# Altium project PFSMPS20.PrjPCB
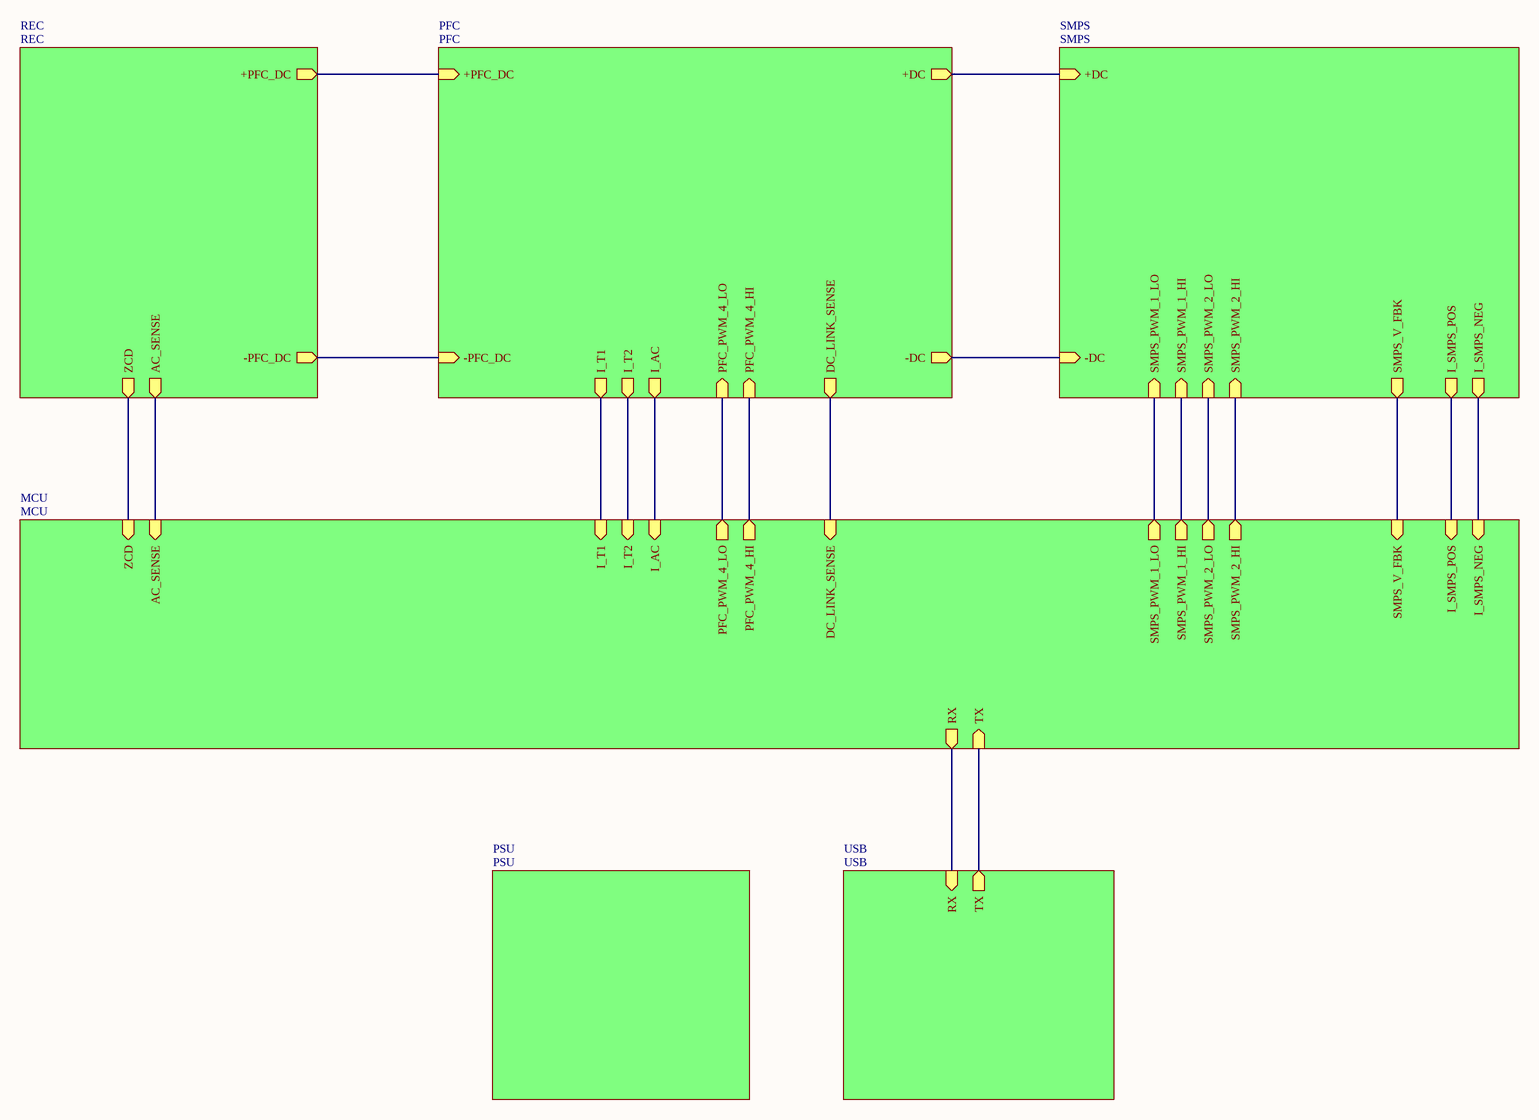
[diagram p0: Main.SchDoc]
7 sheets, 278 parts. Net scope: hierarchical (ports join the sheet entries above them; power ports are global).
Board file: PFSMPS20.PcbDoc
Sheets:
  Main.SchDoc
    REC = REC.SchDoc
    PFC = PFC.SchDoc
    SMPS = SMPS.SchDoc
    PSU = PSU.SchDoc
    USB = USB.SchDoc
    MCU = MCU.SchDoc

## Sheet Main.SchDoc
size A3; Organization: Altium Limited; Address1: L3, 12a Rodborough Rd; Address2: Frenchs Forest; Address3: NSW; Address4: Australia 2086

### Sub-sheets
MCU = MCU: RX (out), TX (in), I_T1 (in), I_T2 (in), I_AC (in), PFC_PWM_4_LO (out), PFC_PWM_4_HI (out), DC_LINK_SENSE (in), SMPS_PWM_2_LO (out), SMPS_PWM_2_HI (out), AC_SENSE (in), ZCD (in), SMPS_V_FBK (in), SMPS_PWM_1_LO (out), SMPS_PWM_1_HI (out), I_SMPS_POS (in), I_SMPS_NEG (in)
PFC = PFC: +PFC_DC (in), -PFC_DC (in), +DC (out), -DC (out), I_T1 (out), I_T2 (out), I_AC (out), PFC_PWM_4_LO (in), PFC_PWM_4_HI (in), DC_LINK_SENSE (out)
PSU = PSU: no entries
REC = REC: +PFC_DC (out), -PFC_DC (out), AC_SENSE (out), ZCD (out)
SMPS = SMPS: +DC (in), -DC (in), SMPS_PWM_2_LO (in), SMPS_PWM_2_HI (in), SMPS_V_FBK (out), SMPS_PWM_1_HI (in), SMPS_PWM_1_LO (in), I_SMPS_POS (out), I_SMPS_NEG (out)
USB = USB: RX (in), TX (out)

### Nets
NetC6_2: sheet PFC/DC_LINK_SENSE, sheet MCU/DC_LINK_SENSE
NetC9_2: sheet REC/AC_SENSE, sheet MCU/AC_SENSE
NetC26_1: sheet REC/-PFC_DC, sheet PFC/-PFC_DC
NetC26_2: sheet REC/+PFC_DC, sheet PFC/+PFC_DC
NetC32_1: sheet PFC/+DC, sheet SMPS/+DC
NetC32_2: sheet PFC/-DC, sheet SMPS/-DC
NetC37_1: sheet PFC/I_T2, sheet MCU/I_T2
NetC38_1: sheet PFC/I_T1, sheet MCU/I_T1
NetC48_2: sheet PFC/I_AC, sheet MCU/I_AC
NetC82_2: sheet SMPS/SMPS_V_FBK, sheet MCU/SMPS_V_FBK
NetD5_K: sheet REC/ZCD, sheet MCU/ZCD
NetD27_1: sheet SMPS/I_SMPS_NEG, sheet MCU/I_SMPS_NEG
NetD27_2: sheet SMPS/I_SMPS_POS, sheet MCU/I_SMPS_POS
NetR32_2: sheet USB/TX, sheet MCU/TX
NetR64_1: sheet PFC/PFC_PWM_4_HI, sheet MCU/PFC_PWM_4_HI
NetR71_1: sheet PFC/PFC_PWM_4_LO, sheet MCU/PFC_PWM_4_LO
NetR101_2: sheet SMPS/SMPS_PWM_1_HI, sheet MCU/SMPS_PWM_1_HI
NetR106_2: sheet SMPS/SMPS_PWM_1_LO, sheet MCU/SMPS_PWM_1_LO
NetR116_2: sheet SMPS/SMPS_PWM_2_HI, sheet MCU/SMPS_PWM_2_HI
NetR120_2: sheet SMPS/SMPS_PWM_2_LO, sheet MCU/SMPS_PWM_2_LO
NetU2_32: sheet USB/RX, sheet MCU/RX

### Notes on the sheet
- Title
- Size:
- Date:
- A3
- Number:
- Time:
- Revision:
- Sheet
- of
- File:

## Sheet REC.SchDoc
size A3; Organization: Altium Limited; Address1: L3, 12a Rodborough Rd; Address2: Frenchs Forest; Address3: NSW; Address4: Australia 2086
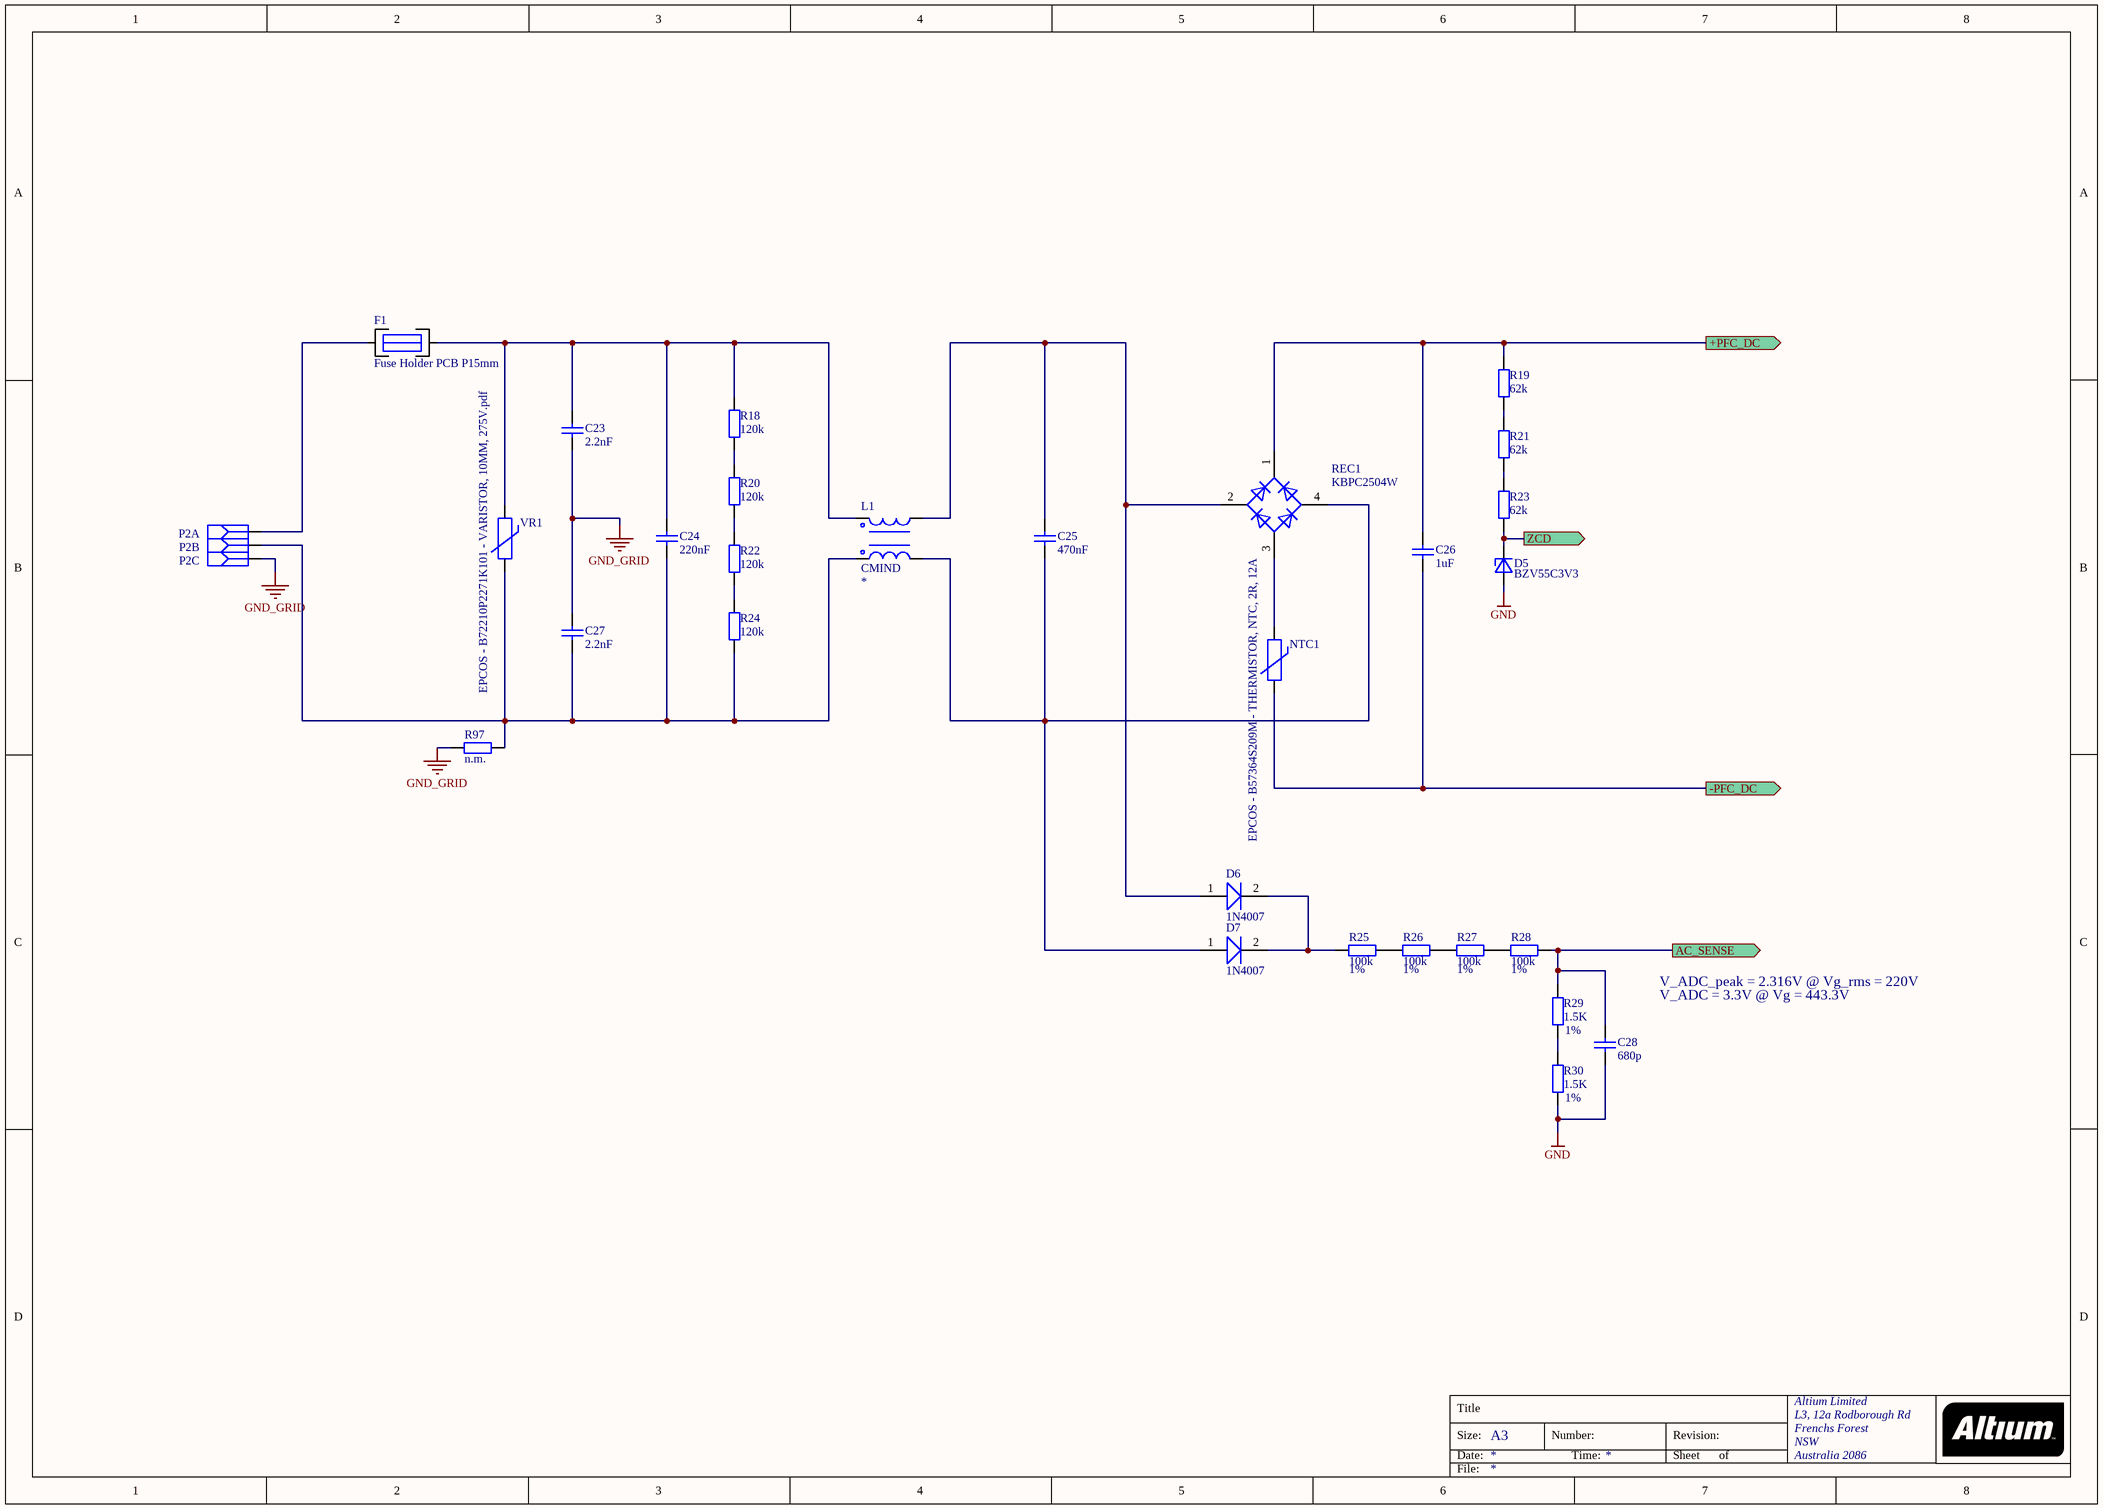
[diagram p1: REC.SchDoc]

### Parts
C23  value 2.2nF  [RECT 18.0X7.0 RM15.0]  (hidden comment: Cap)
C24  value 220nF  [RECT 18.0X7.0 RM15.0]  (hidden comment: Cap)
C25  value 470nF  [RECT 18.0X7.0 RM15.0]  (hidden comment: Cap)
C26  value 1uF  [RECT 18.0X7.0 RM15.0]  (hidden comment: Cap)
C27  value 2.2nF  [RECT 18.0X7.0 RM15.0]  (hidden comment: Cap)
C28  value 680p  [1206_REFLOW]  (hidden comment: Cap 1206)
D5  value BZV55C3V3  [D_MINIMELF_BZV55C5V1(Primary)]  (hidden comment: BZV55CXXX)
D6  1N4007  [AFL-W2/X1.8D]
D7  1N4007  [AFL-W2/X1.8D]
F1  Fuse Holder PCB P15mm  [Fuse Holder PCB P15mm]
L1  CMIND  [CommonModeChoke]
NTC1  value EPCOS - B57364S209M - THERMISTOR, NTC, 2R, 12A  [VARISTOR_14]  (hidden comment: Varristor)
P2  MSTBA 2,5/ 3-G-5,08  [MSTBA2.5/3G-5.08]  (value not drawn)  (parts A,B,C of 3)
R18  value 120k  [1206_REFLOW]  (hidden comment: RES)
R19  value 62k  [RA161004]  (hidden comment: RES)
R20  value 120k  [1206_REFLOW]  (hidden comment: RES)
R21  value 62k  [RA161004]  (hidden comment: RES)
R22  value 120k  [1206_REFLOW]  (hidden comment: RES)
R23  value 62k  [RA161004]  (hidden comment: RES)
R24  value 120k  [1206_REFLOW]  (hidden comment: RES)
R25  value 100k  Tolerance: 1%  [RA161004]  (hidden comment: RES)
R26  value 100k  Tolerance: 1%  [RA161004]  (hidden comment: RES)
R27  value 100k  Tolerance: 1%  [RA161004]  (hidden comment: RES)
R28  value 100k  Tolerance: 1%  [RA161004]  (hidden comment: RES)
R29  value 1.5K  Tolerance: 1%  [RA161004]  (hidden comment: RES)
R30  value 1.5K  Tolerance: 1%  [RA161004]  (hidden comment: RES)
R97  value n.m.  [1206_REFLOW]  (hidden comment: RES)
REC1  KBPC2504W  [KBPC2504W]
VR1  value EPCOS - B72210P2271K101 - VARISTOR, 10MM, 275V.pdf  [VARISTOR_14]  (hidden comment: Varristor)

### Ports
+PFC_DC (out), -PFC_DC (out), AC_SENSE (out), ZCD (out)

### Nets
GND: C28.1 D5.A R30.2
GND_GRID: C23.1 C27.2 P2.3(SIG) R97.1
NetC9_2: C28.2 R28.2 R29.1 ; port AC_SENSE
NetC23_2: C23.2 C24.2 F1.2 L1.1 R18.1 VR1.1
NetC24_1: C24.1 C27.1 L1.3 P2.2(SIG) R24.2 R97.2 VR1.2
NetC25_1: C25.1 D7.1(A) L1.4 REC1.4(C)
NetC25_2: C25.2 D6.1(A) L1.2 REC1.2(C)
NetC26_1: C26.1 NTC1.2 ; port -PFC_DC
NetC26_2: C26.2 R19.1 REC1.1(K) ; port +PFC_DC
NetD5_K: D5.K R23.2 ; port ZCD
NetD6_2: D6.2(K) D7.2(K) R25.1
NetF1_1: F1.1 P2.1(SIG)
NetNTC1_1: NTC1.1 REC1.3(A)
NetR18_2: R18.2 R20.1
NetR19_2: R19.2 R21.1
NetR20_2: R20.2 R22.1
NetR21_2: R21.2 R23.1
NetR22_2: R22.2 R24.1
NetR25_2: R25.2 R26.1
NetR26_2: R26.2 R27.1
NetR27_2: R27.2 R28.1
NetR29_2: R29.2 R30.1

### Notes on the sheet
- V_ADC_peak = 2.316V @ Vg_rms = 220V
- V_ADC = 3.3V @ Vg = 443.3V
- Title
- Size:
- Date:
- A3
- Number:
- Time:
- Revision:
- Sheet
- of
- File:

### Library data of the parts
D5 = BZV55CXXX: Zener Diode
D6 D7 = 1N4007: 1.0 Ampere General Purpose Rectifier; ComponentField6: Published 8-Jun-2000, Modified 11-July-2000: SIM Model Added.; OriginalName: 1N4007; Value: 1N4007
NTC1 VR1 = VAR
  NTC1: Farnell Order Number: 1688802
  VR1: Farnell Order Number: 1781925
P2 = MSTBA 2,5/ 3-G-5,08: Header, right angled, 12 A, 250 V, pitch 5.08 mm, No. of poles:4; Manufacturer: Phoenix; Mfrr. Part No.: 1757268; Group: Connector; Subgroup: Industrial; Value: MSTBA2,5/3; Mounting: TH; Supplier: Any; Order Code: *
R18 R20 R22 R24-R30 R97 = RES 1
  R97: Tolerance: *
R19 R21 R23 = RES 1: Tolerance: 1%
F1 = Fuse Holder PCB P15mm: Value: Fuse Holder PCB P15mm
L1 = CMIND: Value: *
REC1 = KBPC2504W: Value: KBPC2504W

## Sheet PFC.SchDoc
size A3; Organization: Altium Limited; Address1: L3, 12a Rodborough Rd; Address2: Frenchs Forest; Address3: NSW; Address4: Australia 2086
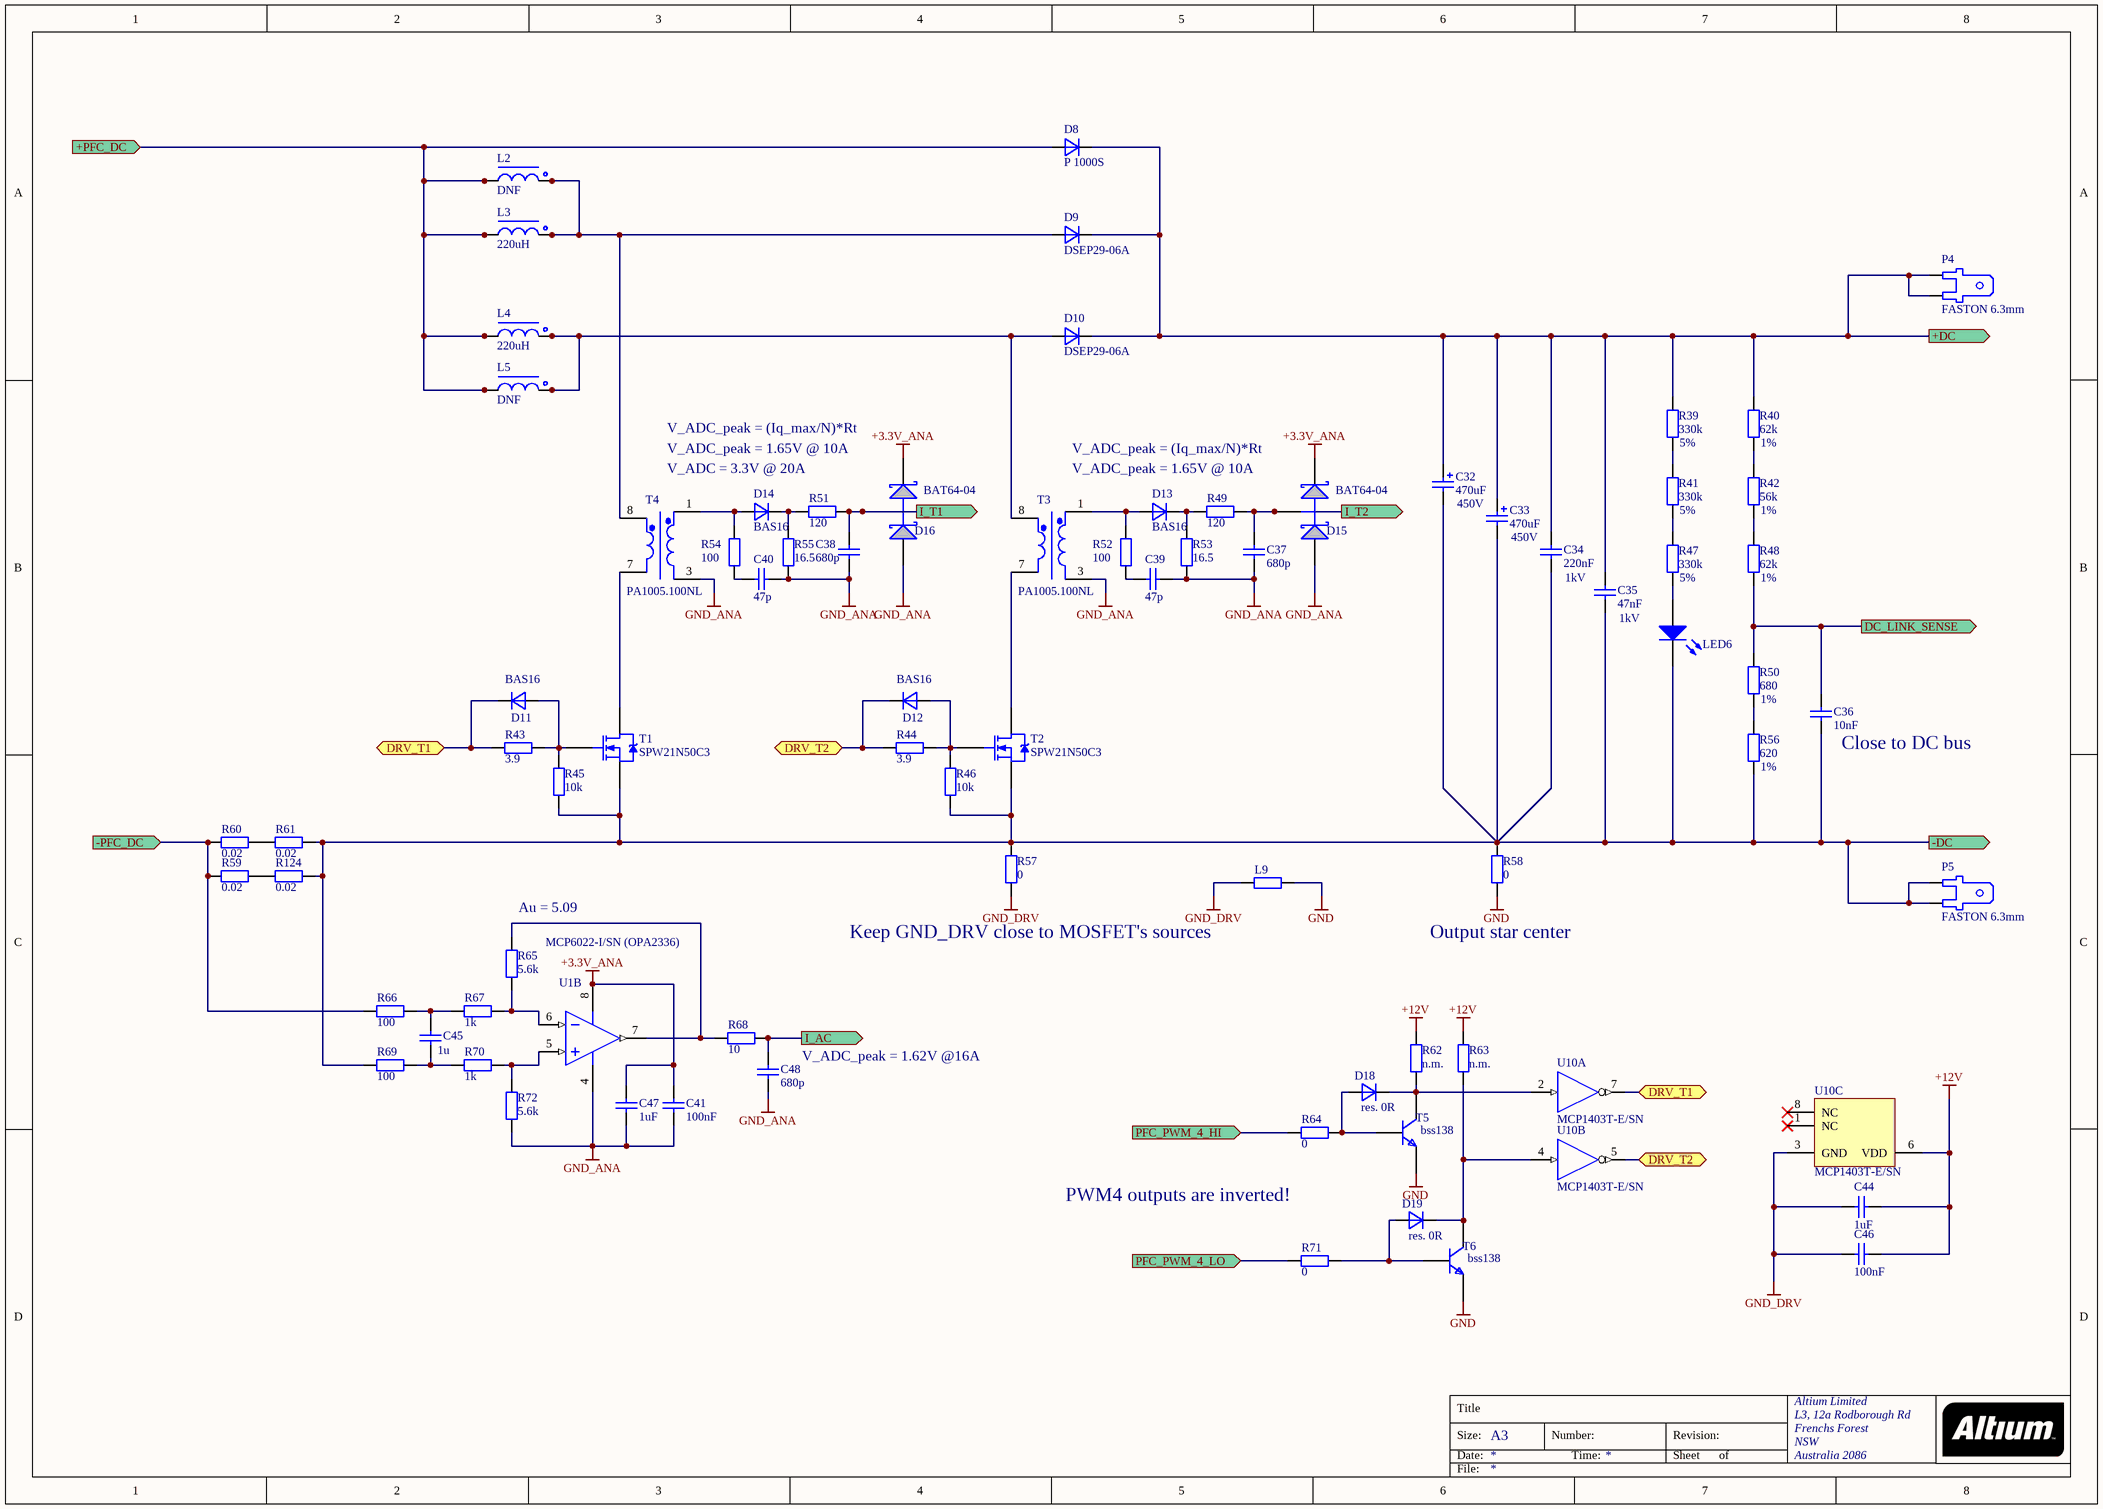
[diagram p2: PFC.SchDoc]

### Parts
C32  value 470uF  Voltage: 450V  [CAPR 52X35]  (hidden comment: Cap)
C33  value 470uF  Voltage: 450V  [CAPR 52X35]  (hidden comment: Cap)
C34  value 220nF  Voltage: 1kV  [RECT 31.0X11.0 RM27.5]  (hidden comment: Cap)
C35  value 47nF  Voltage: 1kV  [RECT 26.5X7.0 RM22.5]  (hidden comment: Cap)
C36  value 10nF  [1206_REFLOW]  (hidden comment: Cap 1206)
C37  value 680p  [1206_REFLOW]  (hidden comment: Cap 1206)
C38  value 680p  [1206_REFLOW]  (hidden comment: Cap 1206)
C39  value 47p  [1206_REFLOW]  (hidden comment: Cap 1206)
C40  value 47p  [1206_REFLOW]  (hidden comment: Cap 1206)
C41  value 100nF  [1206_REFLOW]  (hidden comment: Cap)
C44  value 1uF  [1206_REFLOW]  (hidden comment: Cap 1206)
C45  value 1u  [1206_REFLOW]  (hidden comment: Cap)
C46  value 100nF  [1206_REFLOW]  (hidden comment: Cap 1206)
C47  value 1uF  [1206_REFLOW]  (hidden comment: Cap)
C48  value 680p  [1206_REFLOW]  (hidden comment: Cap)
D8  P 1000S  [P 1000 S]
D9  DSEP29-06A  [Diode TO-220AC-HV]
D10  DSEP29-06A  [Diode TO-220AC-HV]
D11  BAS16  [SOT23_HIS_Primary]
D12  BAS16  [SOT23_HIS_Primary]
D13  BAS16  [SOT23_HIS_Primary]
D14  BAS16  [SOT23_HIS_Primary]
D15  BAT64-04  [SOT23_HIS_Primary]
D16  BAT64-04  [SOT23_HIS_Primary]
D18  value res. 0R  [SOT23_HIS_Primary]  (hidden comment: BAS16)
D19  value res. 0R  [SOT23_HIS_Primary]  (hidden comment: BAS16)
L2  value DNF  [RM-14]  (hidden comment: RM-14 Choke)
L3  value 220uH  [RM-10]  (hidden comment: RM-10 Choke)
L4  value 220uH  [RM-10]  (hidden comment: RM-10 Choke)
L5  value DNF  [RM-14]  (hidden comment: RM-14 Choke)
L9  RES  [1206_REFLOW]  (value not drawn)
LED6  LED  [LED_1206]  (value not drawn)
P4  FASTON 6.3MM  [FASTON 6.3mm]
P5  FASTON 6.3MM  [FASTON 6.3mm]
R39  value 330k  Tolerance: 5%  [RA161004]  (hidden comment: RES)
R40  value 62k  Tolerance: 1%  [RA161004]  (hidden comment: RES)
R41  value 330k  Tolerance: 5%  [RA161004]  (hidden comment: RES)
R42  value 56k  Tolerance: 1%  [RA161004]  (hidden comment: RES)
R43  value 3.9  [1206_REFLOW]  (hidden comment: RES)
R44  value 3.9  [1206_REFLOW]  (hidden comment: RES)
R45  value 10k  [1206_REFLOW]  (hidden comment: RES)
R46  value 10k  [1206_REFLOW]  (hidden comment: RES)
R47  value 330k  Tolerance: 5%  [RA161004]  (hidden comment: RES)
R48  value 62k  Tolerance: 1%  [RA161004]  (hidden comment: RES)
R49  value 120  [1206_REFLOW]  (hidden comment: RES)
R50  value 680  Tolerance: 1%  [RA161004]  (hidden comment: RES)
R51  value 120  [1206_REFLOW]  (hidden comment: RES)
R52  value 100  [1206_REFLOW]  (hidden comment: RES)
R53  value 16.5  [1206_REFLOW]  (hidden comment: RES)
R54  value 100  [1206_REFLOW]  (hidden comment: RES)
R55  value 16.5  [1206_REFLOW]  (hidden comment: RES)
R56  value 620  Tolerance: 1%  [RA161004]  (hidden comment: RES)
R57  value 0  [1206_REFLOW]  (hidden comment: RES)
R58  value 0  [1206_REFLOW]  (hidden comment: RES)
R59  value 0.02  [2512_REFLOW]  (hidden comment: RES)
R60  value 0.02  [2512_REFLOW]  (hidden comment: RES)
R61  value 0.02  [2512_REFLOW]  (hidden comment: RES)
R62  value n.m.  [1206_REFLOW]  (hidden comment: RES)
R63  value n.m.  [1206_REFLOW]  (hidden comment: RES)
R64  value 0  [1206_REFLOW]  (hidden comment: RES)
R65  value 5.6k  [1206_REFLOW]  (hidden comment: RES)
R66  value 100  [1206_REFLOW]  (hidden comment: RES)
R67  value 1k  [1206_REFLOW]  (hidden comment: RES)
R68  value 10  [1206_REFLOW]  (hidden comment: RES)
R69  value 100  [1206_REFLOW]  (hidden comment: RES)
R70  value 1k  [1206_REFLOW]  (hidden comment: RES)
R71  value 0  [1206_REFLOW]  (hidden comment: RES)
R72  value 5.6k  [1206_REFLOW]  (hidden comment: RES)
R124  value 0.02  [2512_REFLOW]  (hidden comment: RES)
T1  value SPW21N50C3  [TO-247HV]  (hidden comment: MOSFET, N, 500V, TO-247)
T2  value SPW21N50C3  [TO-247HV]  (hidden comment: MOSFET, N, 500V, TO-247)
T3  value PA1005.100NL  [PA1005.XXXNL Series]  (hidden comment: PA1005.XXXNL)
T4  value PA1005.100NL  [PA1005.XXXNL Series]  (hidden comment: PA1005.XXXNL)
T5  value bss138  [SOT23_HIS_Primary]  (hidden comment: BC847A)
T6  value bss138  [SOT23_HIS_Primary]  (hidden comment: BC847A)
U1  MCP6022-I/SN (OPA2336)  [SOIC-SN8_N]  (part B of 2)
U10  MCP1403T-E/SN  [SOIC-SN8_N]  (parts A,B,C of 3)

### Ports
+DC (out), +PFC_DC (in), -DC (out), -PFC_DC (in), DC_LINK_SENSE (out), DRV_T1 (bidir), DRV_T2 (bidir), I_AC (out), I_T1 (out), I_T2 (out), PFC_PWM_4_HI (in), PFC_PWM_4_LO (in)

### Nets
+3.3V_ANA: C41.2 C47.2 D15.2(K) D16.2(K) U1.8(VDD)
+12V: C44.1 C46.1 R62.1 R63.1 U10.6(VDD)
GND: L9.2 R58.2 T5.2(E) T6.2(E)
GND_ANA: C37.2 C38.2 C39.1 C40.1 C41.1 C47.1 C48.1 D15.1(A) D16.1(A) R53.1 R55.1 R72.1 T3.3(Sec2+) T4.3(Sec2+) U1.4(VSS)
GND_DRV: C44.2 C46.2 L9.1 R57.2 U10.3(GND)
NetC6_2: C36.2 R48.2 R50.1 ; port DC_LINK_SENSE
NetC26_1: R59.1 R60.1 R66.1 ; port -PFC_DC
NetC26_2: D8.A L2.7 L2.8 L2.9 L2.10 L2.11 L2.12 L3.7 L3.8 L3.9 L3.10 L3.11 L3.12 L4.7 L4.8 L4.9 L4.10 L4.11 L4.12 L5.7 L5.8 L5.9 L5.10 L5.11 L5.12 ; port +PFC_DC
NetC32_1: C32.1 C33.1 C34.2 C35.2 D8.K D9.1(K) D10.1(K) P4.1 P4.2 R39.1 R40.1 ; port +DC
NetC32_2: C32.2 C33.2 C34.1 C35.1 C36.1 LED6.K P5.1 P5.2 R45.1 R46.2 R56.2 R57.1 R58.1 R61.2 R69.1 R124.2 T1.3(S) T2.3(S) ; port -DC
NetC37_1: C37.1 D15.3(C) R49.1 ; port I_T2
NetC38_1: C38.1 D16.3(C) R51.1 ; port I_T1
NetC39_2: C39.2 R52.1
NetC40_2: C40.2 R54.1
NetC45_1: C45.1 R69.2 R70.1
NetC45_2: C45.2 R66.2 R67.1
NetC48_2: C48.2 R68.1 ; port I_AC
NetD9_2: D9.2(A) L2.1 L2.2 L2.3 L2.4 L2.5 L2.6 L3.1 L3.2 L3.3 L3.4 L3.5 L3.6 T4.8(Pri+)
NetD10_2: D10.2(A) L4.1 L4.2 L4.3 L4.4 L4.5 L4.6 L5.1 L5.2 L5.3 L5.4 L5.5 L5.6 T3.8(Pri+)
NetD11_1: D11.1(A) R43.2 R45.2 T1.1(G)
NetD11_3: D11.3(K) R43.1 U10.7(~{OUTA}) ; port DRV_T1
NetD12_1: D12.1(A) R44.1 R46.1 T2.1(G)
NetD12_3: D12.3(K) R44.2 U10.5(~{OUTB}) ; port DRV_T2
NetD13_1: D13.1(A) R52.2 T3.1(Sec1+)
NetD13_3: D13.3(K) R49.2 R53.2
NetD14_1: D14.1(A) R54.2 T4.1(Sec1+)
NetD14_3: D14.3(K) R51.2 R55.2
NetD18_1: D18.1(A) R64.2 T5.1(B)
NetD18_3: D18.3(K) R62.2 T5.3(C) U10.2(INA)
NetD19_1: D19.1(A) R71.2 T6.1(B)
NetD19_3: D19.3(K) R63.2 T6.3(C) U10.4(INB)
NetLED6_A: LED6.A R47.2
NetR39_2: R39.2 R41.1
NetR40_2: R40.2 R42.1
NetR41_2: R41.2 R47.1
NetR42_2: R42.2 R48.1
NetR50_2: R50.2 R56.1
NetR59_2: R59.2 R124.1
NetR60_2: R60.2 R61.1
NetR64_1: R64.1 ; port PFC_PWM_4_HI
NetR65_1: R65.1 R67.2 U1.6(VINB-)
NetR65_2: R65.2 R68.2 U1.7(VOUTB)
NetR70_2: R70.2 R72.2 U1.5(VINB+)
NetR71_1: R71.1 ; port PFC_PWM_4_LO
NetT1_2: T1.2(D) T4.7(Pri-)
NetT2_2: T2.2(D) T3.7(Pri-)

Not connected (* = marked no-connect by the designer): D11 2(NC); D12 2(NC); D13 2(NC); D14 2(NC); D18 2(NC); D19 2(NC); U10 1(NC)* 8(NC)*

### Notes on the sheet
- V_ADC_peak = (Iq_max/N)*Rt
- V_ADC_peak = 1.65V @ 10A
- V_ADC = 3.3V @ 20A
- (near C36) Close to DC bus
- (near R65) Au = 5.09
- Keep GND_DRV close to MOSFET's sources
- (near R58) Output star center
- V_ADC_peak = 1.62V @16A
- PWM4 outputs are inverted!
- Title
- Size:
- Date:
- A3
- Number:
- Time:
- Revision:
- Sheet
- of
- File:

### Library data of the parts
C32 C33 = Cap pol: Manufacturer: *; Manufacturer Order Code: *; Supplier Order Code: *
C34 = Cap: Manufacturer: EPCOS; Manufacturer Order Code: B32654A224J; Supplier Order Code: 1200806
C35 = Cap: Manufacturer: Epcos; Manufacturer Order Code: B32653A0473K; Supplier Order Code: 9751300
D8 = P 1000S: SEMIKRON - P1000S - DIODE, RECTIFIER, 10A, 1200V, AXIAL; Description: Standard silicon rectifier  diode; Value: P 1000S; Farnell Order Number: 1772102
D9 D10 = DSEP29-06A: HiPerFREDTM Epitaxial Diode with soft recovery; Farnell Order Number: 1427265; Value: DSEP29-06A
D11-D14 D18 D19 = BAS16: DIODE, SINGLE SOT-23; Manufacturer: Any; Group: Discrete; Subgroup1: Small Signal; Order Code: BAS16 SMD (SOT23); Subgroup: Diode; Package: SOT23; Mounting: SMD; Supplier: Comet
  D11-D14: Value: BAS16
D15 D16 = BAT64-04: Silicon Schottky Diodes; Manufacturer: INF; ComponentLink1DescBC: Manufacturer Link; Group: Discrete; Subgroup: Diode; Published: 21-Mar-2003; DatasheetDocument: Oct-1999; PackageDocument: Sep-2001; PackageReference: SOT-23; Publisher: Altium Limited; ComponentLink1URL: http://www.infineon.com/; Value: BAT64-04
L2 L5 = RM-xx Choke: Core Gap: *; Wire Size: *; Turns: *
L3 L4 = RM-xx Choke: Core Gap: 0.75mm; Wire Size: 0.9mm; Turns: 37
L9 R39-R48 R50 R52-R58 R62-R64 R71 = RES 1
  L9 R52-R55 R57 R58: Tolerance: *
LED6 = LED: Value: TBD
R49 R51 R65-R70 R72 = RES 1: Tolerance: 1%
R59-R61 R124 = RES 1: MULTICOMP - MCPWR12FTEA2005 - RESISTOR, 2512, 20M 1%, 1.5W; Manufacturer: WELWYN; Power Rating: 2W; Voltage Rating: 200V; Resistor Case Style: 2512; Tolerance: 1%; Farnell Order Code: 1100060RL
T1 T2 = SPW21N50C3: INFINEON - SPW21N50C3 - MOSFET, N, 500V, TO-247; Farnell Order Code: 1471815
T3 T4 = PA1005.XXXNL Series: Manufacturer: PULSE ELECTRONICS CORPORATION; Current Rating: 20A; Turns Ratio - Primary:Secondary: *; Inductance: *; DC Resistance (DCR): *
T5 T6 = BC847A: NPN General Purpose Amplifier; OriginalName: BC847ALT1; ComponentField7: Published 29-Sep-2000; Group: Discrete; Subgroup: Transistor; Subgroup1: NPN General Purpose; Package: SOT23; Mounting: SMD
U1 = MCP6022-I/SN: Rail-to-Rail Input/Output, 10 MHz Operational Amplifier, 8-Pin SOIC, Industrial Temperature; Published: 29-Jan-2009; DatasheetVersion: revC, Mar-2006; PackageVersion: revAW, Oct-2008; PackageReference: SOIC-SN8; Publisher: Altium Limited; PackageDescription: 8-Lead Plastic Small Outline (SN) - Narrow, 3.90mm Body [SOIC]; Code_JEDEC: MS-012; Code_IPC: SOIC127P600-8; ComponentLink1Description: Manufacturer Link; ComponentLink1URL: http://www.microchip.com; ComponentLink2Description: Datasheet; ComponentLink2URL: http://ww1.microchip.com/downloads/en/DeviceDoc/21685c.pdf; ComponentLink3Description: Packaging Specification; ComponentLink3URL: http://ww1.microchip.com/downloads/en/PackagingSpec/00049AW.pdf
U10 = MCP1403T-E/SN: 4.5A Dual High-Speed Power MOSFET Drivers, Inverting, Extended Temperature, Tape and Reel; Published: 29-Jan-2009; DatasheetVersion: revB, May-2007; PackageVersion: revAW, Oct-2008; PackageReference: SOIC-SN8; Publisher: Altium Limited; PackageDescription: 8-Lead Plastic Small Outline (SN) - Narrow, 3.90mm Body [SOIC]; Code_JEDEC: MS-012; Code_IPC: SOIC127P600-8; ComponentLink1Description: Manufacturer Link; ComponentLink1URL: http://www.microchip.com; ComponentLink2Description: Datasheet; ComponentLink2URL: http://ww1.microchip.com/downloads/en/DeviceDoc/22022b.pdf; ComponentLink3Description: Packaging Specification; ComponentLink3URL: http://ww1.microchip.com/downloads/en/PackagingSpec/00049AW.pdf
C36-C40 C44 C46 = Cap 1206
  C37 C38: Supplier: *; Supplier Order Code: *; Manufacturer: *; Manufacturer Order Code: *; Voltage: *; Tolerance: *; Series: X7R
  C39 C40: Supplier: *; Supplier Order Code: *; Manufacturer: *; Manufacturer Order Code: *; Voltage: *; Tolerance: *; Series: *
C41 C45 C47 C48 = Cap: Voltage: *; Manufacturer: *; Supplier Order Code: *; Manufacturer Order Code: *; Supplier: *
P4 P5 = FASTON 6.3MM: Value: FASTON 6.3mm

## Sheet SMPS.SchDoc
size A3; Organization: Altium Limited; Address1: L3, 12a Rodborough Rd; Address2: Frenchs Forest; Address3: NSW; Address4: Australia 2086
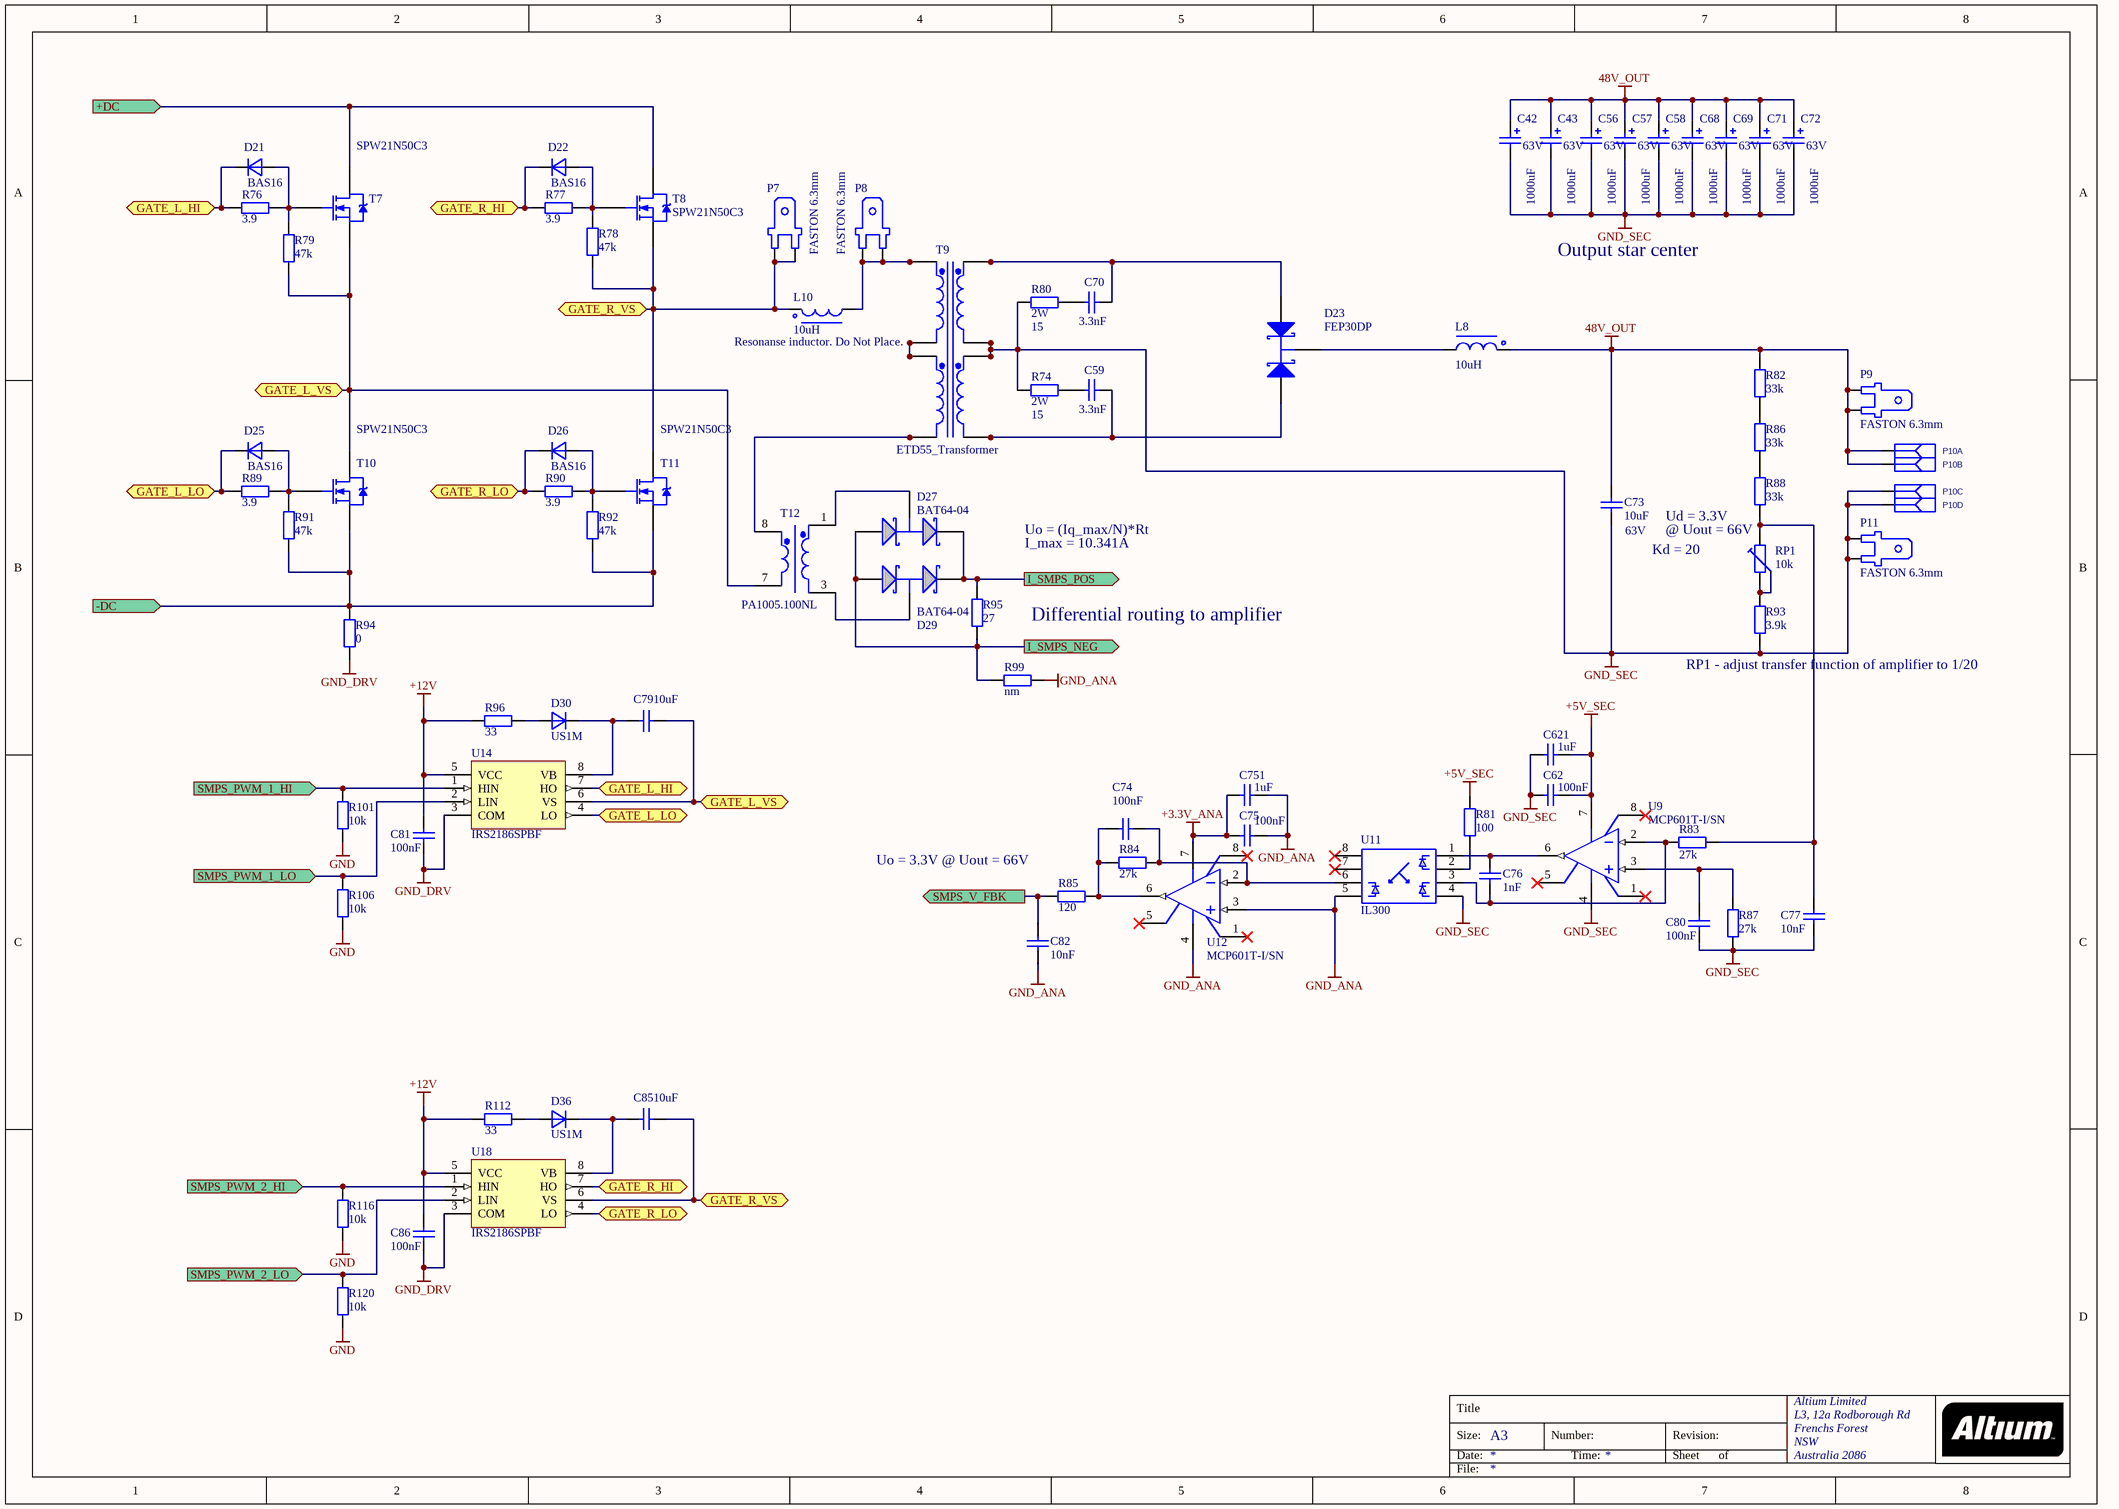
[diagram p3: SMPS.SchDoc]

### Parts
C42  value 1000uF  Voltage: 63V  [CAPPR7.5-18x35.5]  (hidden comment: Cap)
C43  value 1000uF  Voltage: 63V  [CAPPR7.5-18x35.5]  (hidden comment: Cap)
C56  value 1000uF  Voltage: 63V  [CAPPR7.5-18x35.5]  (hidden comment: Cap)
C57  value 1000uF  Voltage: 63V  [CAPPR7.5-18x35.5]  (hidden comment: Cap)
C58  value 1000uF  Voltage: 63V  [CAPPR7.5-18x35.5]  (hidden comment: Cap)
C59  value 3.3nF  [CAP26X19P22_5H]  (hidden comment: Cap)
C62  value 100nF  [1206_REFLOW]  (hidden comment: Cap 1206)
C68  value 1000uF  Voltage: 63V  [CAPPR7.5-18x35.5]  (hidden comment: Cap)
C69  value 1000uF  Voltage: 63V  [CAPPR7.5-18x35.5]  (hidden comment: Cap)
C70  value 3.3nF  [CAP26X19P22_5H]  (hidden comment: Cap)
C71  value 1000uF  Voltage: 63V  [CAPPR7.5-18x35.5]  (hidden comment: Cap)
C72  value 1000uF  Voltage: 63V  [CAPPR7.5-18x35.5]  (hidden comment: Cap)
C73  value 10uF  Voltage: 63V  [RECT 26.5X8.5 RM22.5]  (hidden comment: Cap)
C74  value 100nF  [1206_REFLOW]  (hidden comment: Cap 1206)
C75  value 100nF  [1206_REFLOW]  (hidden comment: Cap 1206)
C76  value 1nF  [1206_REFLOW]  (hidden comment: Cap 1206)
C77  value 10nF  [1206_REFLOW]  (hidden comment: Cap 1206)
C79  value 10uF  [1206_REFLOW]  (hidden comment: Cap 1206)
C80  value 100nF  [1206_REFLOW]  (hidden comment: Cap 1206)
C81  value 100nF  [1206_REFLOW]  (hidden comment: Cap 1206)
C82  value 10nF  [1206_REFLOW]  (hidden comment: Cap)
C85  value 10uF  [1206_REFLOW]  (hidden comment: Cap 1206)
C86  value 100nF  [1206_REFLOW]  (hidden comment: Cap 1206)
C621  value 1uF  [1206_REFLOW]  (hidden comment: Cap 1206)
C751  value 1uF  [1206_REFLOW]  (hidden comment: Cap 1206)
D21  BAS16  [SOT23_HIS_Primary]
D22  BAS16  [SOT23_HIS_Primary]
D23  value FEP30DP  [TO-247HV]  (hidden comment: DIODE, ULTRAFAST, 30 A, TO-3P)
D25  BAS16  [SOT23_HIS_Primary]
D26  BAS16  [SOT23_HIS_Primary]
D27  BAT64-04  [SOT23_HIS_Primary]
D29  BAT64-04  [SOT23_HIS_Primary]
D30  US1M  [DO-214_S1A(Primary)]
D36  US1M  [DO-214_S1A(Primary)]
L8  value 10uH  [BOURNS - SRP1270-100M]  (hidden comment: SRP1270-100M)
L10  Resonanse inductor. Do Not Place.  value 10uH  [BOURNS - SRP1270-100M]
P7  FASTON 6.3MM  [FASTON 6.3mm]
P8  FASTON 6.3MM  [FASTON 6.3mm]
P9  FASTON 6.3MM  [FASTON 6.3mm]
P10  MSTBA 2,5/ 4-G-5,08  [MSTBA2.5/4G-5.08]  (value not drawn)  (parts A,B,C,D of 4)
P11  FASTON 6.3MM  [FASTON 6.3mm]
R74  2W  value 15  [5.5x16mm (2W BODY RES)]
R76  value 3.9  [1206_REFLOW]  (hidden comment: RES)
R77  value 3.9  [1206_REFLOW]  (hidden comment: RES)
R78  value 47k  [1206_REFLOW]  (hidden comment: RES)
R79  value 47k  [1206_REFLOW]  (hidden comment: RES)
R80  2W  value 15  [5.5x16mm (2W BODY RES)]
R81  value 100  [1206_REFLOW]  (hidden comment: RES)
R82  value 33k  [1206_REFLOW]  (hidden comment: RES)
R83  value 27k  [1206_REFLOW]  (hidden comment: RES)
R84  value 27k  [1206_REFLOW]  (hidden comment: RES)
R85  value 120  [1206_REFLOW]  (hidden comment: RES)
R86  value 33k  [1206_REFLOW]  (hidden comment: RES)
R87  value 27k  [1206_REFLOW]  (hidden comment: RES)
R88  value 33k  [1206_REFLOW]  (hidden comment: RES)
R89  value 3.9  [1206_REFLOW]  (hidden comment: RES)
R90  value 3.9  [1206_REFLOW]  (hidden comment: RES)
R91  value 47k  [1206_REFLOW]  (hidden comment: RES)
R92  value 47k  [1206_REFLOW]  (hidden comment: RES)
R93  value 3.9k  [1206_REFLOW]  (hidden comment: RES)
R94  value 0  [1206_REFLOW]  (hidden comment: RES)
R95  value 27  [1206_REFLOW]  (hidden comment: RES)
R96  value 33  [1206_REFLOW]  (hidden comment: RES)
R99  value nm  [1206_REFLOW]  (hidden comment: RES)
R101  value 10k  [1206_REFLOW]  (hidden comment: RES)
R106  value 10k  [1206_REFLOW]  (hidden comment: RES)
R112  value 33  [1206_REFLOW]  (hidden comment: RES)
R116  value 10k  [1206_REFLOW]  (hidden comment: RES)
R120  value 10k  [1206_REFLOW]  (hidden comment: RES)
RP1  value 10k  [BOURNS3296W]  (hidden comment: Trimmer)
T7  value SPW21N50C3  [TO-247HV]  (hidden comment: MOSFET, N, 500V, TO-247)
T8  value SPW21N50C3  [TO-247HV]  (hidden comment: MOSFET, N, 500V, TO-247)
T9  ETD55_Transformer  [ETD54_Transformer]
T10  value SPW21N50C3  [TO-247HV]  (hidden comment: MOSFET, N, 500V, TO-247)
T11  value SPW21N50C3  [TO-247HV]  (hidden comment: MOSFET, N, 500V, TO-247)
T12  value PA1005.100NL  [PA1005.XXXNL Series]  (hidden comment: PA1005.XXXNL)
U9  MCP601T-I/SN  [SOIC-SN8_N]
U11  value IL300  [DIP8 6n138]  (hidden comment: Analog optocoupler)
U12  MCP601T-I/SN  [SOIC-SN8_N]
U14  IRS2186SPBF  [SO-8_N]
U18  IRS2186SPBF  [SO-8_N]

### Ports
+DC (in), -DC (in), GATE_L_HI (bidir), GATE_L_LO (bidir), GATE_L_VS (bidir), GATE_R_HI (bidir), GATE_R_LO (bidir), GATE_R_VS (bidir), I_SMPS_NEG (out), I_SMPS_POS (out), SMPS_PWM_1_HI (in), SMPS_PWM_1_LO (in), SMPS_PWM_2_HI (in), SMPS_PWM_2_LO (in), SMPS_V_FBK (out)

### Nets
48V_OUT: C42.1 C43.1 C56.1 C57.1 C58.1 C68.1 C69.1 C71.1 C72.1 C73.2 L8.2 P9.1 P9.2 P10.1(SIG) P10.2(SIG) R82.1
+3.3V_ANA: C75.1 C751.1 U12.7(VDD)
+5V_SEC: C62.2 C621.2 R81.1 U9.7(VDD)
+12V: C81.1 C86.1 R96.1 R112.1 U14.5(VCC) U18.5(VCC)
GND: R101.1 R106.1 R116.1 R120.1
GND_ANA: C75.2 C82.1 C751.2 R99.2 U11.5(GND) U12.3(VIN+) U12.4(VSS)
GND_DRV: C81.2 C86.2 R94.2 U14.3(COM) U18.3(COM)
GND_SEC: C42.2 C43.2 C56.2 C57.2 C58.2 C62.1 C68.2 C69.2 C71.2 C72.2 C73.1 C77.1 C80.1 C621.1 P10.3(SIG) P10.4(SIG) P11.1 P11.2 R74.2 R80.2 R87.2 R93.2 T9.14(Sec2+) T9.15(Sec2+) T9.19(Sec2+) T9.20(Sec2+) U9.4(VSS) U11.4
NetC32_1: T7.2(D) T8.2(D) ; port +DC
NetC32_2: R91.2 R92.1 R94.1 T10.3(S) T11.3(S) ; port -DC
NetC59_1: C59.1 R74.1
NetC59_2: C59.2 D23.3(A2) T9.12(Sec2+) T9.13(Sec2+)
NetC70_1: C70.1 R80.1
NetC70_2: C70.2 D23.1(A1) T9.21(Sec1+) T9.22(Sec1+)
NetC74_1: C74.1 R84.1 R85.2 U12.6(VOUT)
NetC74_2: C74.2 R84.2 U11.6(O2) U12.2(VIN-)
NetC76_1: C76.1 U9.6(VOUT) U11.1
NetC76_2: C76.2 R83.1 U9.2(VIN-) U11.3
NetC77_2: C77.2 R83.2 R88.2 RP1.3
NetC79_1: C79.1 R79.1 T7.3(S) T10.2(D) T12.7(Pri-) U14.6(VS) ; port GATE_L_VS
NetC79_2: C79.2 D30.K U14.8(VB)
NetC80_2: C80.2 R87.1 U9.3(VIN+)
NetC82_2: C82.2 R85.1 ; port SMPS_V_FBK
NetC85_1: C85.1 L10.2 P7.1 P7.2 R78.2 T8.3(S) T11.2(D) U18.6(VS) ; port GATE_R_VS
NetC85_2: C85.2 D36.K U18.8(VB)
NetD21_1: D21.1(A) R76.2 R79.2 T7.1(G)
NetD21_3: D21.3(K) R76.1 U14.7(HO) ; port GATE_L_HI
NetD22_1: D22.1(A) R77.1 R78.1 T8.1(G)
NetD22_3: D22.3(K) R77.2 U18.7(HO) ; port GATE_R_HI
NetD23_2: D23.2(K) L8.1
NetD25_1: D25.1(A) R89.1 R91.1 T10.1(G)
NetD25_3: D25.3(K) R89.2 U14.4(LO) ; port GATE_L_LO
NetD26_1: D26.1(A) R90.2 R92.2 T11.1(G)
NetD26_3: D26.3(K) R90.1 U18.4(LO) ; port GATE_R_LO
NetD27_1: D27.1(A) D29.1(A) R95.2 R99.1 ; port I_SMPS_NEG
NetD27_2: D27.2(K) D29.2(K) R95.1 ; port I_SMPS_POS
NetD27_3: D27.3(C) T12.3(Sec2+)
NetD29_3: D29.3(C) T12.1(Sec1+)
NetD30_A: D30.A R96.2
NetD36_A: D36.A R112.2
NetL10_1: L10.1 P8.1 P8.2 T9.1(Pri+) T9.2(Pri+)
NetR81_2: R81.2 U11.2
NetR82_2: R82.2 R86.1
NetR86_2: R86.2 R88.1
NetR93_1: R93.1 RP1.1 RP1.2
NetR101_2: R101.2 U14.1(HIN) ; port SMPS_PWM_1_HI
NetR106_2: R106.2 U14.2(LIN) ; port SMPS_PWM_1_LO
NetR116_2: R116.2 U18.1(HIN) ; port SMPS_PWM_2_HI
NetR120_2: R120.2 U18.2(LIN) ; port SMPS_PWM_2_LO
NetT9_3: T9.3(Pri-) T9.4(Pri+) T9.8(Pri+) T9.9(Pri+)
NetT9_10: T9.10(Pri-) T9.11(Pri+) T12.8(Pri+)

Not connected (* = marked no-connect by the designer): D21 2(NC); D22 2(NC); D25 2(NC); D26 2(NC); U9 1(NC)* 5(NC)* 8(NC)*; U11 7(O1)* 8*; U12 1(NC)* 5(NC)* 8(NC)*

### Notes on the sheet
- Output star center
- Uo = (Iq_max/N)*Rt
- I_max = 10.341A
- Kd = 20
- Ud = 3.3V
- (near RP1) @ Uout = 66V
- Differential routing to amplifier
- (near R93) RP1 - adjust transfer function of amplifier to 1/20
- (near R85) Uo = 3.3V @ Uout = 66V
- Title
- Size:
- Date:
- A3
- Number:
- Time:
- Revision:
- Sheet
- of
- File:

### Library data of the parts
C42 C43 C56-C58 C68 C69 C71 C72 = Cap pol: Manufacturer: *; Manufacturer Order Code: *; Supplier Order Code: *
C73 = Cap: Manufacturer: WIMA; Manufacturer Order Code: MKS4C051005F00KSSD; Supplier Order Code: CW 10uF 63V 10% MKS4
D21 D22 D25 D26 = BAS16: as D11 on sheet PFC; Subgroup: Diode; Package: SOT23; Mounting: SMD; Supplier: Comet; Value: BAS16
D23 = FEP30DP: Schottky Rectifier; Manufacturer: VISHAY GENERAL SEMICONDUCTOR; Order Code: 1612308
D27 D29 = BAT64-04: as D15 on sheet PFC; Published: 21-Mar-2003; DatasheetDocument: Oct-1999; PackageDocument: Sep-2001; PackageReference: SOT-23; Publisher: Altium Limited; ComponentLink1URL: http://www.infineon.com/; Value: BAT64-04
D30 D36 = S1A: Value: US1M
L8 L10 = BOURNS - SRP1270-xxxM: BOURNS - SRP1270-100M - INDUCTOR, SMD, 10UH, 16A; Order Code: 1828128; Rated Current: 16A; Manufacturer: Bourns; Manufacturer Order Code: SRP1270-100M
P10 = MSTBA 2,5/ 4-G-5,08: Header, right angled, 12 A, 250 V, pitch 5.08 mm, No. of poles:4; Manufacturer: Phoenix; Mfrr. Part No.: 1757268; Group: Connector; Subgroup: Industrial; Value: MSTBA2,5/4; Mounting: TH; Supplier: Any; Order Code: *
R74 R76-R81 R83-R85 R87 R89-R92 R94-R96 R99 R101 R106 R112 R116 R120 = RES 1
  R81 R83-R85 R87 R94-R96 R99 R112: Tolerance: *
R82 R86 R88 R93 = RES 1: Tolerance: 1%
RP1 = Res Trim: Tolerance: *
T7 T8 T10 T11 = SPW21N50C3: as T1 on sheet PFC; Farnell Order Code: 1471815
T9 = ETD55_Transformer: Core Manufacturer: Kashke; Primary Voltage: 400V; Secondary Voltage: 2x24V; Core Material Type: EPCOS; Core Geometry: ETD54; Primary Turns: *; Secondary Turns: *; Primary Wire Size: *; Secondary Wire Size: *
T12 = PA1005.XXXNL Series: as T3 on sheet PFC; Turns Ratio - Primary:Secondary: *; Inductance: *; DC Resistance (DCR): *
U9 U12 = MCP601T-I/SN: 2.7V to 6.0V Single Supply CMOS Operational Amplifier, 8-Pin SOIC, Industrial Temperature, Tape and Reel; Published: 29-Jan-2009; DatasheetVersion: revG, Dec-2007; PackageVersion: revAW, Oct-2008; PackageReference: SOIC-SN8; Publisher: Altium Limited; PackageDescription: 8-Lead Plastic Small Outline (SN) - Narrow, 3.90mm Body [SOIC]; Code_JEDEC: MS-012; Code_IPC: SOIC127P600-8; ComponentLink1Description: Manufacturer Link; ComponentLink1URL: http://www.microchip.com; ComponentLink2Description: Datasheet; ComponentLink2URL: http://ww1.microchip.com/downloads/en/DeviceDoc/21314g.pdf; ComponentLink3Description: Packaging Specification; ComponentLink3URL: http://ww1.microchip.com/downloads/en/PackagingSpec/00049AW.pdf
U11 = IL300
U14 U18 = IRS2186SPBF: Half-Bridge Driver; Published: 8-Jun-2000; LatestRevisionDate: 13-Apr-2006; LatestRevisionNote: IPC-7351 Footprint Added.; DatasheetVersion: PD60028J; PackageVersion: Feb-2001; PackageReference: SO-8; Publisher: Altium Limited; PackageDescription: 8-Pin Plastic Small Outline Integrated Circuit 1.27 mm Pitch; Code_JEDEC: MS-012-AA; Code_IPC: SOIC127P600-8; ComponentLink1Description: Manufacturer Link; ComponentLink1URL: http://www.irf.com/; ComponentLink2Description: Datasheet
C59 C70 C82 = Cap: Voltage: *; Manufacturer: *
  C59 C70: Order Code: *
  C82: Supplier Order Code: *; Manufacturer Order Code: *; Supplier: *
C62 C74-C77 C79-C81 C85 C86 C621 C751 = Cap 1206: Supplier: *; Supplier Order Code: *; Manufacturer: *; Manufacturer Order Code: *; Voltage: *; Tolerance: *; Series: *
P7-P9 P11 = FASTON 6.3MM: Value: FASTON 6.3mm

## Sheet PSU.SchDoc
size A4; Organization: Altium Limited; Address1: L3, 12a Rodborough Rd; Address2: Frenchs Forest; Address3: NSW; Address4: Australia 2086
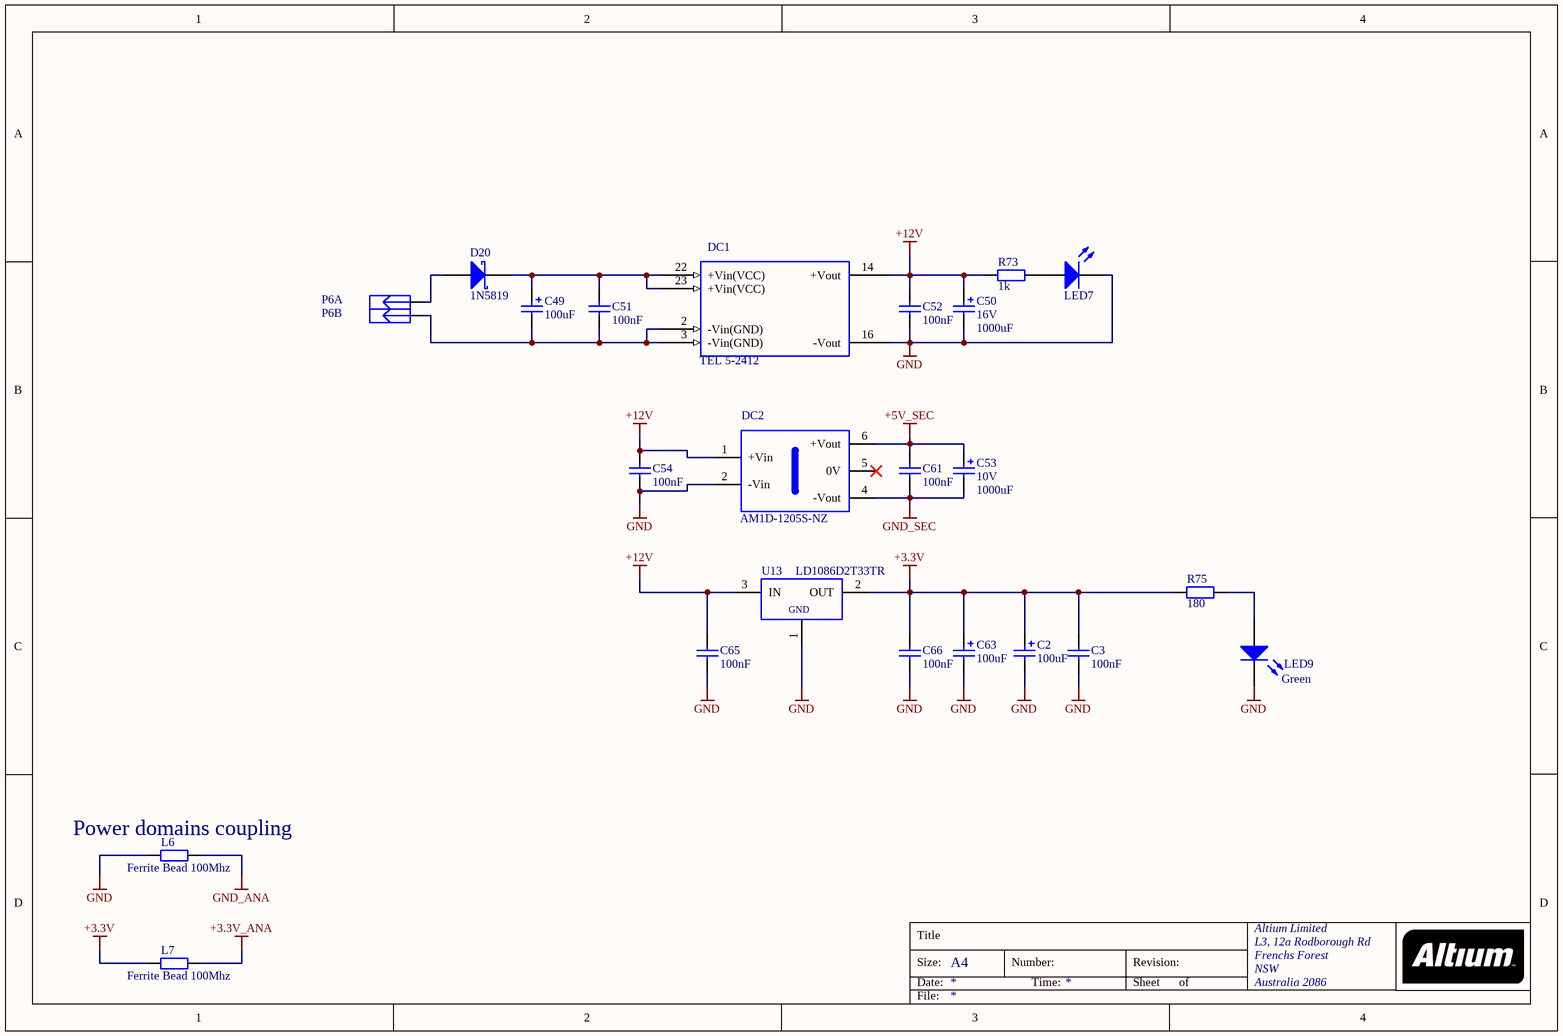
[diagram p4: PSU.SchDoc]

### Parts
C2  value 100uF  [CAPPR3.5-8x12]  (hidden comment: Cap)
C3  value 100nF  [1206_REFLOW]  (hidden comment: Cap 1206)
C49  value 100uF  [CAPPR3.5-8x12]  (hidden comment: Cap)
C50  value 1000uF  Voltage: 16V  [RA_8.0_RM3.5]  (hidden comment: Cap)
C51  value 100nF  [1206_REFLOW]  (hidden comment: Cap 1206)
C52  value 100nF  [1206_REFLOW]  (hidden comment: Cap 1206)
C53  value 1000uF  Voltage: 10V  [RA_8.0_RM3.5]  (hidden comment: Cap)
C54  value 100nF  [1206_REFLOW]  (hidden comment: Cap 1206)
C61  value 100nF  [1206_REFLOW]  (hidden comment: Cap 1206)
C63  value 100uF  [CAPPR3.5-8x12]  (hidden comment: Cap)
C65  value 100nF  [1206_REFLOW]  (hidden comment: Cap 1206)
C66  value 100nF  [1206_REFLOW]  (hidden comment: Cap 1206)
D20  1N5819  [DO-214_S1A(Primary)]
DC1  value TEL 5-2412  [DIP24_TRACO]  (hidden comment: EC3A21HM)
DC2  value AM1D-1205S-NZ  [-AM1D_AM1D-D(Primary)]  (hidden comment: AM1D-D)
L6  value Ferrite Bead 100Mhz  [1206_REFLOW]  (hidden comment: RES)
L7  value Ferrite Bead 100Mhz  [1206_REFLOW]  (hidden comment: RES)
LED7  LED  [LED_1206]  (value not drawn)
LED9  Green  [LED_1206]
P6  MSTBA 2,5/ 2-G-5,08  [STLZ950 2G-5.08-H]  (value not drawn)  (parts A,B of 2)
R73  value 1k  [1206_REFLOW]  (hidden comment: RES)
R75  value 180  [1206_REFLOW]  (hidden comment: RES)
U13  LD1086D2T33TR  [D2PAK]

### Nets
+3.3V: C2.1 C3.2 C63.1 C66.2 L7.1 R75.1 U13.2(OUT)
+3.3V_ANA: L7.2
+5V_SEC: C53.1 C61.2 DC2.6(+Vout)
+12V: C50.1 C52.2 C54.2 C65.2 DC1.14(+Vout) DC2.1(+Vin) R73.1 U13.3(IN)
GND: C2.2 C3.1 C50.2 C52.1 C54.1 C63.2 C65.1 C66.1 DC1.16(-Vout) DC2.2(-Vin) L6.1 LED7.K LED9.K U13.1(GND)
GND_ANA: L6.2
GND_SEC: C53.2 C61.1 DC2.4(-Vout)
NetC49_1: C49.1 C51.2 D20.K DC1.22(+Vin(VCC)) DC1.23(+Vin(VCC))
NetC49_2: C49.2 C51.1 DC1.2(-Vin(GND)) DC1.3(-Vin(GND)) P6.2(SIG)
NetD20_A: D20.A P6.1(SIG)
NetLED7_A: LED7.A R73.2
NetLED9_A: LED9.A R75.2

Not connected (* = marked no-connect by the designer): DC2 5(0V)*

### Notes on the sheet
- (near L6) Power domains coupling
- Title
- Size:
- Date:
- A4
- Number:
- Time:
- Revision:
- Sheet
- of
- File:

### Library data of the parts
C2 C49 C50 C53 C63 = Cap pol
  C50 C53: Manufacturer: *; Manufacturer Order Code: *; Supplier Order Code: *
DC1 = EC3A21HM: DC/DC CONVERTER, 3W 5V; Manufacturer: CINCON; Group: IC; Subgroup: Power Management; Subgroup1: DC-DC Converter; Supplier: Any; Order code: *; Package: DIL24; Mounting: TH; Mfrr. Part No.: EC3A21HM
DC2 = AM1D-D: Manufacturer 1: AIMTEC; Mfr 1 PN: AM1D-xxxxD; PN: 01060409-xxxx-xxxx; Group: Power Supply, Battery & Accessory; Detail: 1W DC/DC converters Dual output; Order code 1: {Order code 1}; Case: SIP7; Supplier 1: Comet; Price 1: {Price 1}
L6 L7 R73 R75 = RES 1
LED7 LED9 = LED: Value: TBD
P6 = MSTBA 2,5/ 2-G-5,08: Header, right angled, 12 A, 250 V, pitch 5.08 mm, No. of poles:2; Manufacturer: Phoenix; Mfrr. Part No.: 1757242; Group: Connector; Subgroup: Industrial; Value: MSTBA2,5/2; Supplier: Any; Mounting: TH; Package: TH; Order Code: *
U13 = LD1086-XX: STMICROELECTRONICS - LD1086D2T33TR - IC, V REG, LDO 3.3V, SMD; Value: LD1086D2T33TR
D20 = 1N5819: Value: 1N5819

## Sheet USB.SchDoc
size A4; Organization: Altium Limited; Address1: L3, 12a Rodborough Rd; Address2: Frenchs Forest; Address3: NSW; Address4: Australia 2086
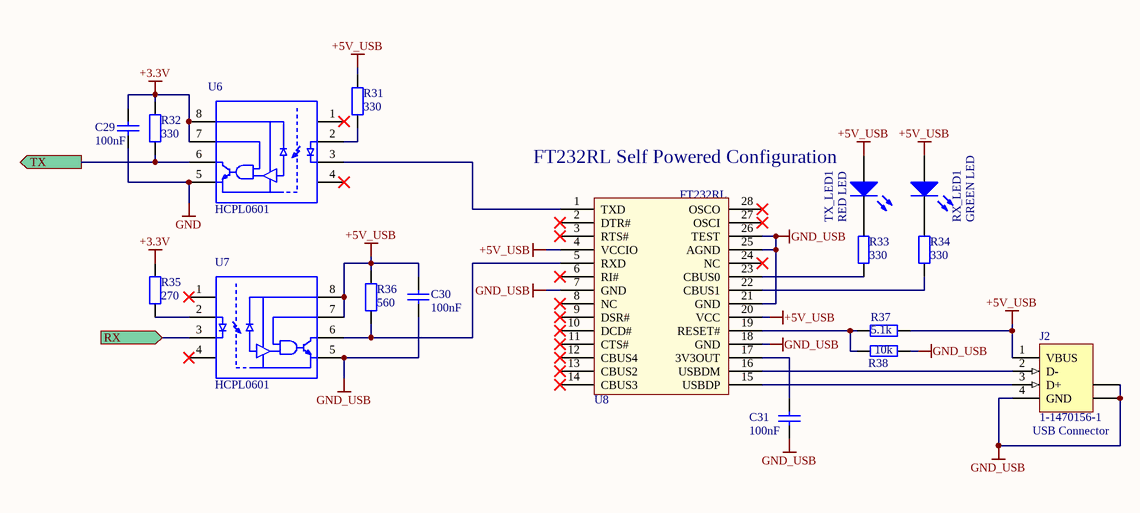
[diagram p5: USB.SchDoc]

### Parts
C29  value 100nF  [1206_REFLOW]  (hidden comment: Cap 1206)
C30  value 100nF  [1206_REFLOW]  (hidden comment: Cap 1206)
C31  value 100nF  [3216[1206]]  (hidden comment: Cap)
J2  1-1470156-1  [USB2.5-2H4D]
R31  value 330  [1206_REFLOW]  (hidden comment: RES)
R32  value 330  [1206_REFLOW]  (hidden comment: RES)
R33  value 330  [3216[1206]]  (hidden comment: Resistor)
R34  value 330  [3216[1206]]  (hidden comment: Resistor)
R35  value 270  [1206_REFLOW]  (hidden comment: RES)
R36  value 560  [1206_REFLOW]  (hidden comment: RES)
R37  value 5.1k  [3216[1206]]  (hidden comment: Resistor)
R38  value 10k  [3216[1206]]  (hidden comment: Resistor)
RX_LED1  GREEN LED  [LED_1206]
TX_LED1  RED LED  [LED_1206]
U6  HCPL0601  [SO8_HIS]
U7  HCPL0601  [SO8_HIS]
U8  FT232RL  [SSOP28]

### Ports
RX (in), TX (out)

### Nets
+3.3V: C29.1 R32.1 R35.1 U6.7(Ve) U6.8(Vcc)
+5V_USB: C30.1 J2.1(VBUS) R31.1 R36.1 R37.2 RX_LED1.A TX_LED1.A U7.7(Ve) U7.8(Vcc) U8.4(VCCIO) U8.20(VCC)
GND: C29.2 U6.5(GND)
GND_USB: C30.2 C31.1 J2.4(GND) J2.5(SHLD) J2.6(SHLD) R38.1 U7.5(GND) U8.7(GND) U8.18(GND) U8.21(GND) U8.25(AGND) U8.26(TEST)
NetC31_2: C31.2 U8.17(3V3OUT)
NetJ2_2: J2.2(D-) U8.16(USBDM)
NetJ2_3: J2.3(D+) U8.15(USBDP)
NetR31_2: R31.2 U6.2(Vf+)
NetR32_2: R32.2 U6.6(Vo) ; port TX
NetR33_1: R33.1 U8.23(CBUS0)
NetR33_2: R33.2 TX_LED1.K
NetR34_1: R34.1 U8.22(CBUS1)
NetR34_2: R34.2 RX_LED1.K
NetR35_2: R35.2 U7.2(Vf+)
NetR36_2: R36.2 U7.6(Vo) U8.5(RXD)
NetR37_1: R37.1 R38.2 U8.19(RESET#)
NetU2_32: U7.3(Vf-) ; port RX
NetU6_3: U6.3(Vf-) U8.1(TXD)

Not connected (* = marked no-connect by the designer): U6 1(N/C)* 4(N/C)*; U7 1(N/C)* 4(N/C)*; U8 2(DTR#)* 3(RTS#)* 6(RI#)* 8(NC)* 9(DSR#)* 10(DCD#)* 11(CTS#)* 12(CBUS4)* 13(CBUS2)* 14(CBUS3)* 24(NC)* 27(OSCI)* 28(OSCO)*

### Notes on the sheet
- (near TX_LED1) FT232RL Self Powered Configuration
- (near J2) USB Connector
- Title
- Size:
- Date:
- A4
- Number:
- Time:
- Revision:
- Sheet
- of
- File:

### Library data of the parts
J2 = 1-1470156-1: USB 1.1, Right Angle, Thru-Hole, B Type, Receptacle, 4 Position, White; ContactMaterial: Phosphor Bronze; ContactPlating: Gold over Nickel; TerminationLength: 3.00mm [0.118in.]; PCB_Layout: Complies with manufacturer's recommendation.; DrillSize: Corresponds to nominal value.; PanelGround: Without; Published: 15-Jul-2004; DatasheetDocument: 02-Jun-2001; PackageDocument: 02-Jun-2001; PackageReference: 1-1470156; Publisher: Altium Limited; HousingMaterial: Glass-Filled Thermoplastic; ComponentLink1Description: Manufacturer Link; ComponentLink1URL: http://www.tycoelectronics.com/; ComponentLink2Description: Packaging Specification; ComponentLink2URL: http://ecommas.tycoelectronics.com/commerce/DocumentDelivery/DDEController?Action=showdoc&DocId=Customer+Drawing%7F1470156%7FO%7Ftif%7FEnglish%7FC_1470156_O.tif
R31 R32 R35 R36 = RES 1
R33 R34 R37 R38 = RES1
RX_LED1 TX_LED1 = LED: Value: TBD
U6 U7 = HCPL0601: Value: HCPL0601
U8 = FT232RL: Value: FT232RL

## Sheet MCU.SchDoc
size A3; Organization: Altium Limited; Address1: L3, 12a Rodborough Rd; Address2: Frenchs Forest; Address3: NSW; Address4: Australia 2086
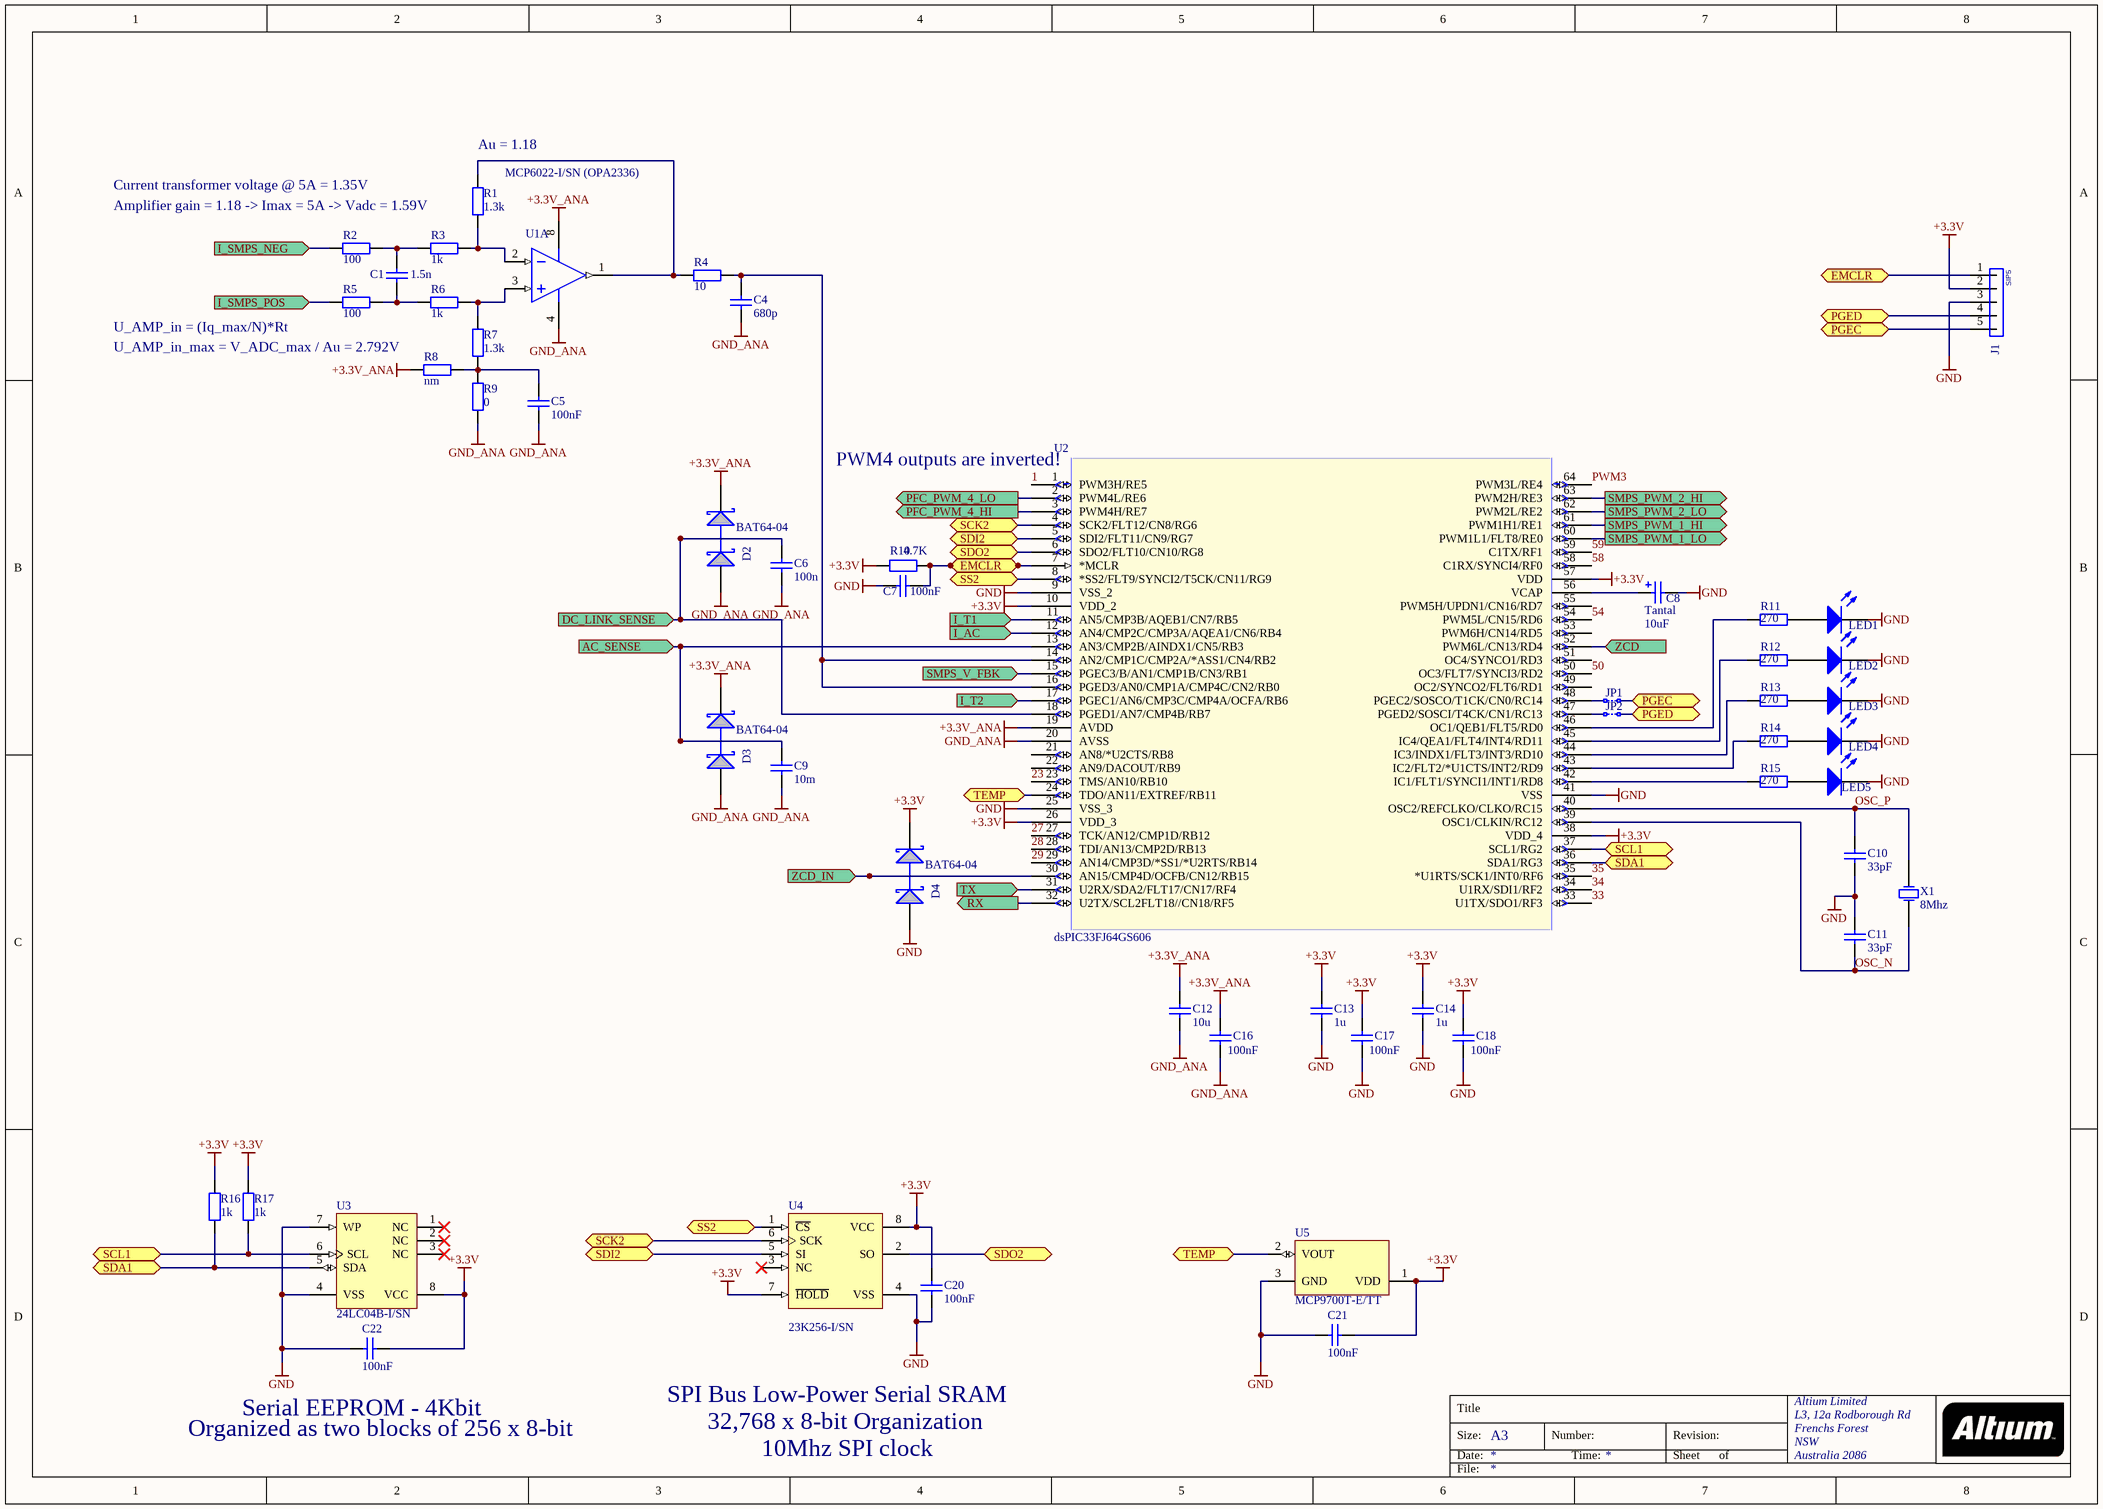
[diagram p6: MCU.SchDoc]

### Parts
C1  value 1.5n  [1206_REFLOW]  (hidden comment: Cap)
C4  value 680p  [1206_REFLOW]  (hidden comment: Cap)
C5  value 100nF  [1206_REFLOW]  (hidden comment: Cap)
C6  value 100n  [1206_REFLOW]  (hidden comment: Cap 1206)
C7  value 100nF  [1206_REFLOW]  (hidden comment: Cap 1206)
C8  Tantal  value 10uF  [CASE D]
C9  value 10m  [1206_REFLOW]  (hidden comment: Cap 1206)
C10  value 33pF  [1206_REFLOW]  (hidden comment: Cap)
C11  value 33pF  [1206_REFLOW]  (hidden comment: Cap)
C12  value 10u  [1206_REFLOW]  (hidden comment: Cap 1206)
C13  value 1u  [1206_REFLOW]  (hidden comment: Cap 1206)
C14  value 1u  [1206_REFLOW]  (hidden comment: Cap 1206)
C16  value 100nF  [1206_REFLOW]  (hidden comment: Cap 1206)
C17  value 100nF  [1206_REFLOW]  (hidden comment: Cap 1206)
C18  value 100nF  [1206_REFLOW]  (hidden comment: Cap 1206)
C20  value 100nF  [1206_REFLOW]  (hidden comment: Cap 1206)
C21  value 100nF  [1206_REFLOW]  (hidden comment: Cap 1206)
C22  value 100nF  [1206_REFLOW]  (hidden comment: Cap 1206)
D2  BAT64-04  [SOT23_HIS_Primary]
D3  BAT64-04  [SOT23_HIS_Primary]
D4  BAT64-04  [SOT23_HIS_Primary]
J1  SIP5  [SIP5 _2]
JP1  SOLDERCONTACT  [SOLDERCONTACT]  (value not drawn)
JP2  SOLDERCONTACT  [SOLDERCONTACT]  (value not drawn)
LED1  LED  [LED_1206]  (value not drawn)
LED2  LED  [LED_1206]  (value not drawn)
LED3  LED  [LED_1206]  (value not drawn)
LED4  LED  [LED_1206]  (value not drawn)
LED5  LED  [LED_1206]  (value not drawn)
R1  value 1.3k  [1206_REFLOW]  (hidden comment: RES)
R2  value 100  [1206_REFLOW]  (hidden comment: RES)
R3  value 1k  [1206_REFLOW]  (hidden comment: RES)
R4  value 10  [1206_REFLOW]  (hidden comment: RES)
R5  value 100  [1206_REFLOW]  (hidden comment: RES)
R6  value 1k  [1206_REFLOW]  (hidden comment: RES)
R7  value 1.3k  [1206_REFLOW]  (hidden comment: RES)
R8  value nm  [1206_REFLOW]  (hidden comment: RES)
R9  value 0  [1206_REFLOW]  (hidden comment: RES)
R10  value 4.7K  [1206_REFLOW]  (hidden comment: RES)
R11  value 270  [1206_REFLOW]  (hidden comment: RES)
R12  value 270  [1206_REFLOW]  (hidden comment: RES)
R13  value 270  [1206_REFLOW]  (hidden comment: RES)
R14  value 270  [1206_REFLOW]  (hidden comment: RES)
R15  value 270  [1206_REFLOW]  (hidden comment: RES)
R16  value 1k  [1206_REFLOW]  (hidden comment: RES)
R17  value 1k  [1206_REFLOW]  (hidden comment: RES)
U1  MCP6022-I/SN (OPA2336)  [SOIC-SN8_N]  (part A of 2)
U2  dsPIC33FJ64GS606  [TQFP-PT64_N]
U3  24LC04B-I/SN  [SOIC-SN8_N]
U4  23K256-I/SN  [SOIC-SN8_N]
U5  MCP9700T-E/TT  [SOT-23-TT3_N]
X1  value 8Mhz  [XTAL]  (hidden comment: XTAL)

### Ports
AC_SENSE (in), DC_LINK_SENSE (in), EMCLR, I_AC (in), I_SMPS_NEG (in), I_SMPS_POS (in), I_T1 (in), I_T2 (in), PFC_PWM_4_HI (out), PFC_PWM_4_LO (out), PGEC, PGED, RX (out), SCK2 (bidir), SCL1 (bidir), SDA1 (bidir), SDI2 (bidir), SDO2 (bidir), SMPS_PWM_1_HI (out), SMPS_PWM_1_LO (out), SMPS_PWM_2_HI (out), SMPS_PWM_2_LO (out), SMPS_V_FBK (in), SS2, TEMP (bidir), TX (in), ZCD (in), ZCD_IN (in)

### Nets
+3.3V: C13.2 C14.2 C17.2 C18.2 C20.1 C21.1 C22.1 D4.2(K) J1.2 R10.1 R16.1 R17.1 U2.10(VDD_2) U2.26(VDD_3) U2.38(VDD_4) U2.57(VDD) U3.8(VCC) U4.7(~{HOLD}) U4.8(VCC) U5.1(VDD)
+3.3V_ANA: C12.2 C16.2 D2.2(K) D3.2(K) R8.1 U1.8(VDD) U2.19(AVDD)
GND: C7.1 C8.2 C10.1 C11.2 C13.1 C14.1 C17.1 C18.1 C20.2 C21.2 C22.2 D4.1(A) J1.3 LED1.K LED2.K LED3.K LED4.K LED5.K U2.9(VSS_2) U2.25(VSS_3) U2.41(VSS) U3.4(VSS) U3.7(WP) U4.4(VSS) U5.3(GND)
GND_ANA: C4.1 C5.1 C6.1 C9.1 C12.1 C16.1 D2.1(A) D3.1(A) R9.1 U1.4(VSS) U2.20(AVSS)
1: U2.1(PWM3H/RE5)
23: U2.23(TMS/AN10/RB10)
27: U2.27(TCK/AN12/CMP1D/RB12)
28: U2.28(TDI/AN13/CMP2D/RB13)
29: U2.29(AN14/CMP3D/*SS1/*U2RTS/RB14)
33: U2.33(U1TX/SDO1/RF3)
34: U2.34(U1RX/SDI1/RF2)
35: U2.35(*U1RTS/SCK1/INT0/RF6)
50: U2.50(OC3/FLT7/SYNCI3/RD2)
54: U2.54(PWM5L/CN15/RD6)
58: U2.58(C1RX/SYNCI4/RF0)
59: U2.59(C1TX/RF1)
OSC_N: C11.1 U2.39(OSC1/CLKIN/RC12) X1.1(OSC1)
OSC_P: C10.2 U2.40(OSC2/REFCLKO/CLKO/RC15) X1.2(OSC2)
PWM3: U2.64(PWM3L/RE4)
NetC1_1: C1.1 R5.2 R6.1
NetC1_2: C1.2 R2.2 R3.1
NetC4_2: C4.2 R4.1 U2.14(AN2/CMP1C/CMP2A/*ASS1/CN4/RB2) U2.16(PGED3/AN0/CMP1A/CMP4C/CN2/RB0)
NetC5_2: C5.2 R7.1 R8.2 R9.2
NetC6_2: C6.2 D2.3(C) U2.18(PGED1/AN7/CMP4B/RB7) ; port DC_LINK_SENSE
NetC7_2: C7.2 J1.1 R10.2 U2.7(*MCLR) ; port EMCLR
NetC8_1: C8.1 U2.56(VCAP)
NetC9_2: C9.2 D3.3(C) U2.13(AN3/CMP2B/AINDX1/CN5/RB3) ; port AC_SENSE
NetC37_1: U2.17(PGEC1/AN6/CMP3C/CMP4A/OCFA/RB6) ; port I_T2
NetC38_1: U2.11(AN5/CMP3B/AQEB1/CN7/RB5) ; port I_T1
NetC48_2: U2.12(AN4/CMP2C/CMP3A/AQEA1/CN6/RB4) ; port I_AC
NetC82_2: U2.15(PGEC3/B/AN1/CMP1B/CN3/RB1) ; port SMPS_V_FBK
NetD4_3: D4.3(C) U2.30(AN15/CMP4D/OCFB/CN12/RB15) ; port ZCD_IN
NetD5_K: U2.52(PWM6L/CN13/RD4) ; port ZCD
NetD27_1: R2.1 ; port I_SMPS_NEG
NetD27_2: R5.1 ; port I_SMPS_POS
NetJ1_4: J1.4 JP2.1 ; port PGED
NetJ1_5: J1.5 JP1.2 ; port PGEC
NetJP1_1: JP1.1 U2.48(PGEC2/SOSCO/T1CK/CN0/RC14)
NetJP2_2: JP2.2 U2.47(PGED2/SOSCI/T4CK/CN1/RC13)
NetLED1_A: LED1.A R11.2
NetLED2_A: LED2.A R12.2
NetLED3_A: LED3.A R13.2
NetLED4_A: LED4.A R14.2
NetLED5_A: LED5.A R15.2
NetR1_1: R1.1 R3.2 U1.2(VINA-)
NetR1_2: R1.2 R4.2 U1.1(VOUTA)
NetR6_2: R6.2 R7.2 U1.3(VINA+)
NetR11_1: R11.1 U2.46(OC1/QEB1/FLT5/RD0)
NetR12_1: R12.1 U2.45(IC4/QEA1/FLT4/INT4/RD11)
NetR13_1: R13.1 U2.44(IC3/INDX1/FLT3/INT3/RD10)
NetR14_1: R14.1 U2.43(IC2/FLT2/*U1CTS/INT2/RD9)
NetR15_1: R15.1 U2.42(IC1/FLT1/SYNCI1/INT1/RD8)
NetR16_2: R16.2 U2.36(SDA1/RG3) U3.5(SDA) ; port SDA1
NetR17_2: R17.2 U2.37(SCL1/RG2) U3.6(SCL) ; port SCL1
NetR32_2: U2.31(U2RX/SDA2/FLT17/CN17/RF4) ; port TX
NetR64_1: U2.3(PWM4H/RE7) ; port PFC_PWM_4_HI
NetR71_1: U2.2(PWM4L/RE6) ; port PFC_PWM_4_LO
NetR101_2: U2.61(PWM1H1/RE1) ; port SMPS_PWM_1_HI
NetR106_2: U2.60(PWM1L1/FLT8/RE0) ; port SMPS_PWM_1_LO
NetR116_2: U2.63(PWM2H/RE3) ; port SMPS_PWM_2_HI
NetR120_2: U2.62(PWM2L/RE2) ; port SMPS_PWM_2_LO
NetU2_4: U2.4(SCK2/FLT12/CN8/RG6) U4.6(SCK) ; port SCK2
NetU2_5: U2.5(SDI2/FLT11/CN9/RG7) U4.5(SI) ; port SDI2
NetU2_6: U2.6(SDO2/FLT10/CN10/RG8) U4.2(SO) ; port SDO2
NetU2_8: U2.8(*SS2/FLT9/SYNCI2/T5CK/CN11/RG9) U4.1(~{CS}) ; port SS2
NetU2_24: U2.24(TDO/AN11/EXTREF/RB11) U5.2(VOUT) ; port TEMP
NetU2_32: U2.32(U2TX/SCL2FLT18//CN18/RF5) ; port RX

Not connected (* = marked no-connect by the designer): U2 21(AN8/*U2CTS/RB8) 22(AN9/DACOUT/RB9) 49(OC2/SYNCO2/FLT6/RD1) 51(OC4/SYNCO1/RD3) 53(PWM6H/CN14/RD5) 55(PWM5H/UPDN1/CN16/RD7); U3 1(NC)* 2(NC)* 3(NC)*; U4 3(NC)*

### Notes on the sheet
- (near R1) Au = 1.18
- Current transformer voltage @ 5A = 1.35V
- (near R1) Amplifier gain = 1.18 -> Imax = 5A -> Vadc = 1.59V
- U_AMP_in = (Iq_max/N)*Rt
- U_AMP_in_max = V_ADC_max / Au = 2.792V
- (near U2) PWM4 outputs are inverted!
- Organized as two blocks of 256 x 8-bit
- (near C22) Serial EEPROM - 4Kbit
- SPI Bus Low-Power Serial SRAM
- 32,768 x 8-bit Organization
- 10Mhz SPI clock
- Title
- Size:
- Date:
- A3
- Number:
- Time:
- Revision:
- Sheet
- of
- File:

### Library data of the parts
C8 = CAP CASE D
D2-D4 = BAT64-04: as D15 on sheet PFC; Published: 21-Mar-2003; DatasheetDocument: Oct-1999; PackageDocument: Sep-2001; PackageReference: SOT-23; Publisher: Altium Limited; ComponentLink1URL: http://www.infineon.com/; Value: BAT64-04
JP1 JP2 = SOLDERCONTACT: Value: JP
LED1-LED5 = LED: Value: TBD
R1 R7-R17 = RES 1
  R1 R7-R9 R11-R15: Tolerance: *
R2-R6 = RES 1: Tolerance: 1%
U1 = MCP6022-I/SN: as U1 on sheet PFC; Published: 29-Jan-2009; DatasheetVersion: revC, Mar-2006; PackageVersion: revAW, Oct-2008; PackageReference: SOIC-SN8; Publisher: Altium Limited; PackageDescription: 8-Lead Plastic Small Outline (SN) - Narrow, 3.90mm Body [SOIC]; Code_JEDEC: MS-012; Code_IPC: SOIC127P600-8; ComponentLink1Description: Manufacturer Link; ComponentLink1URL: http://www.microchip.com; ComponentLink2Description: Datasheet; ComponentLink2URL: http://ww1.microchip.com/downloads/en/DeviceDoc/21685c.pdf; ComponentLink3Description: Packaging Specification; ComponentLink3URL: http://ww1.microchip.com/downloads/en/PackagingSpec/00049AW.pdf
U3 = 24LC04B-I/SN: 4Kbit, 400kHz, 2.5V, I2C Serial EEPROM, 8-Pin SOIC 150mil, Industrial Temperature; Published: 29-Jan-2009; DatasheetVersion: revG, Mar-2007; PackageVersion: revAW, Oct-2008; PackageReference: SOIC-SN8; Publisher: Altium Limited; PackageDescription: 8-Lead Plastic Small Outline (SN) - Narrow, 3.90mm Body [SOIC]; Code_JEDEC: MS-012; Code_IPC: SOIC127P600-8; ComponentLink1Description: Manufacturer Link; ComponentLink1URL: http://www.microchip.com; ComponentLink2Description: Datasheet; ComponentLink2URL: http://ww1.microchip.com/downloads/en/DeviceDoc/21708G.pdf; ComponentLink3Description: Packaging Specification; ComponentLink3URL: http://ww1.microchip.com/downloads/en/PackagingSpec/00049AW.pdf
U4 = 25LC640AT-I/SN: IC, SRAM, SERIAL, 256K, 2.7V, SOIC8; Value: 23K256-I/SN; Farnell Order Code: 1695547
U5 = MCP9700T-E/TT: Low-Power Linear Active Thermistor IC, 3-Pin SOT-23, Extended Temperature, Tape and Reel; Published: 29-Jan-2009; DatasheetVersion: revD, Oct-2007; PackageVersion: revAW, Oct-2008; PackageReference: SOT-23-TT3; Publisher: Altium Limited; Code_IPC: SOT23-3; ComponentLink1Description: Manufacturer Link; ComponentLink1URL: http://www.microchip.com; ComponentLink2Description: Datasheet; ComponentLink2URL: http://ww1.microchip.com/downloads/en/DeviceDoc/21942d.pdf; ComponentLink3Description: Packaging Specification; ComponentLink3URL: http://ww1.microchip.com/downloads/en/PackagingSpec/00049AW.pdf
C1 C4 C5 C10 C11 = Cap
  C1 C4 C5: Voltage: *; Manufacturer: *; Supplier Order Code: *; Manufacturer Order Code: *; Supplier: *
J1 = SIP5: Value: *

## Nets that join several sheets
+3.3V: PSU (7 pins), USB (5 pins), MCU (20 pins)
+3.3V_ANA: PFC (5 pins), SMPS (C75.1 C751.1 U12.7), PSU (L7.2), MCU (7 pins)
+5V_SEC: SMPS (C62.2 C621.2 R81.1 U9.7), PSU (C53.1 C61.2 DC2.6)
+12V: PFC (5 pins), SMPS (6 pins), PSU (8 pins)
GND: REC (C28.1 D5.A R30.2), PFC (L9.2 R58.2 T5.2 T6.2), SMPS (R101.1 R106.1 R116.1 R120.1), PSU (14 pins), USB (C29.2 U6.5), MCU (25 pins)
GND_ANA: PFC (15 pins), SMPS (7 pins), PSU (L6.2), MCU (11 pins)
GND_DRV: PFC (5 pins), SMPS (5 pins)
GND_SEC: SMPS (28 pins), PSU (C53.2 C61.1 DC2.4)
NetC6_2: PFC (C36.2 R48.2 R50.1), MCU (C6.2 D2.3 U2.18)
NetC9_2: REC (C28.2 R28.2 R29.1), MCU (C9.2 D3.3 U2.13)
NetC26_1: REC (C26.1 NTC1.2), PFC (R59.1 R60.1 R66.1)
NetC26_2: REC (C26.2 R19.1 REC1.1), PFC (25 pins)
NetC32_1: PFC (11 pins), SMPS (T7.2 T8.2)
NetC32_2: PFC (18 pins), SMPS (5 pins)
NetC37_1: PFC (C37.1 D15.3 R49.1), MCU (U2.17)
NetC38_1: PFC (C38.1 D16.3 R51.1), MCU (U2.11)
NetC48_2: PFC (C48.2 R68.1), MCU (U2.12)
NetC82_2: SMPS (C82.2 R85.1), MCU (U2.15)
NetD5_K: REC (D5.K R23.2), MCU (U2.52)
NetD27_1: SMPS (D27.1 D29.1 R95.2 R99.1), MCU (R2.1)
NetD27_2: SMPS (D27.2 D29.2 R95.1), MCU (R5.1)
NetR32_2: USB (R32.2 U6.6), MCU (U2.31)
NetR64_1: PFC (R64.1), MCU (U2.3)
NetR71_1: PFC (R71.1), MCU (U2.2)
NetR101_2: SMPS (R101.2 U14.1), MCU (U2.61)
NetR106_2: SMPS (R106.2 U14.2), MCU (U2.60)
NetR116_2: SMPS (R116.2 U18.1), MCU (U2.63)
NetR120_2: SMPS (R120.2 U18.2), MCU (U2.62)
NetU2_32: USB (U7.3), MCU (U2.32)